# EAGLE design Board Mekanum (EAGLE 7.6.0)
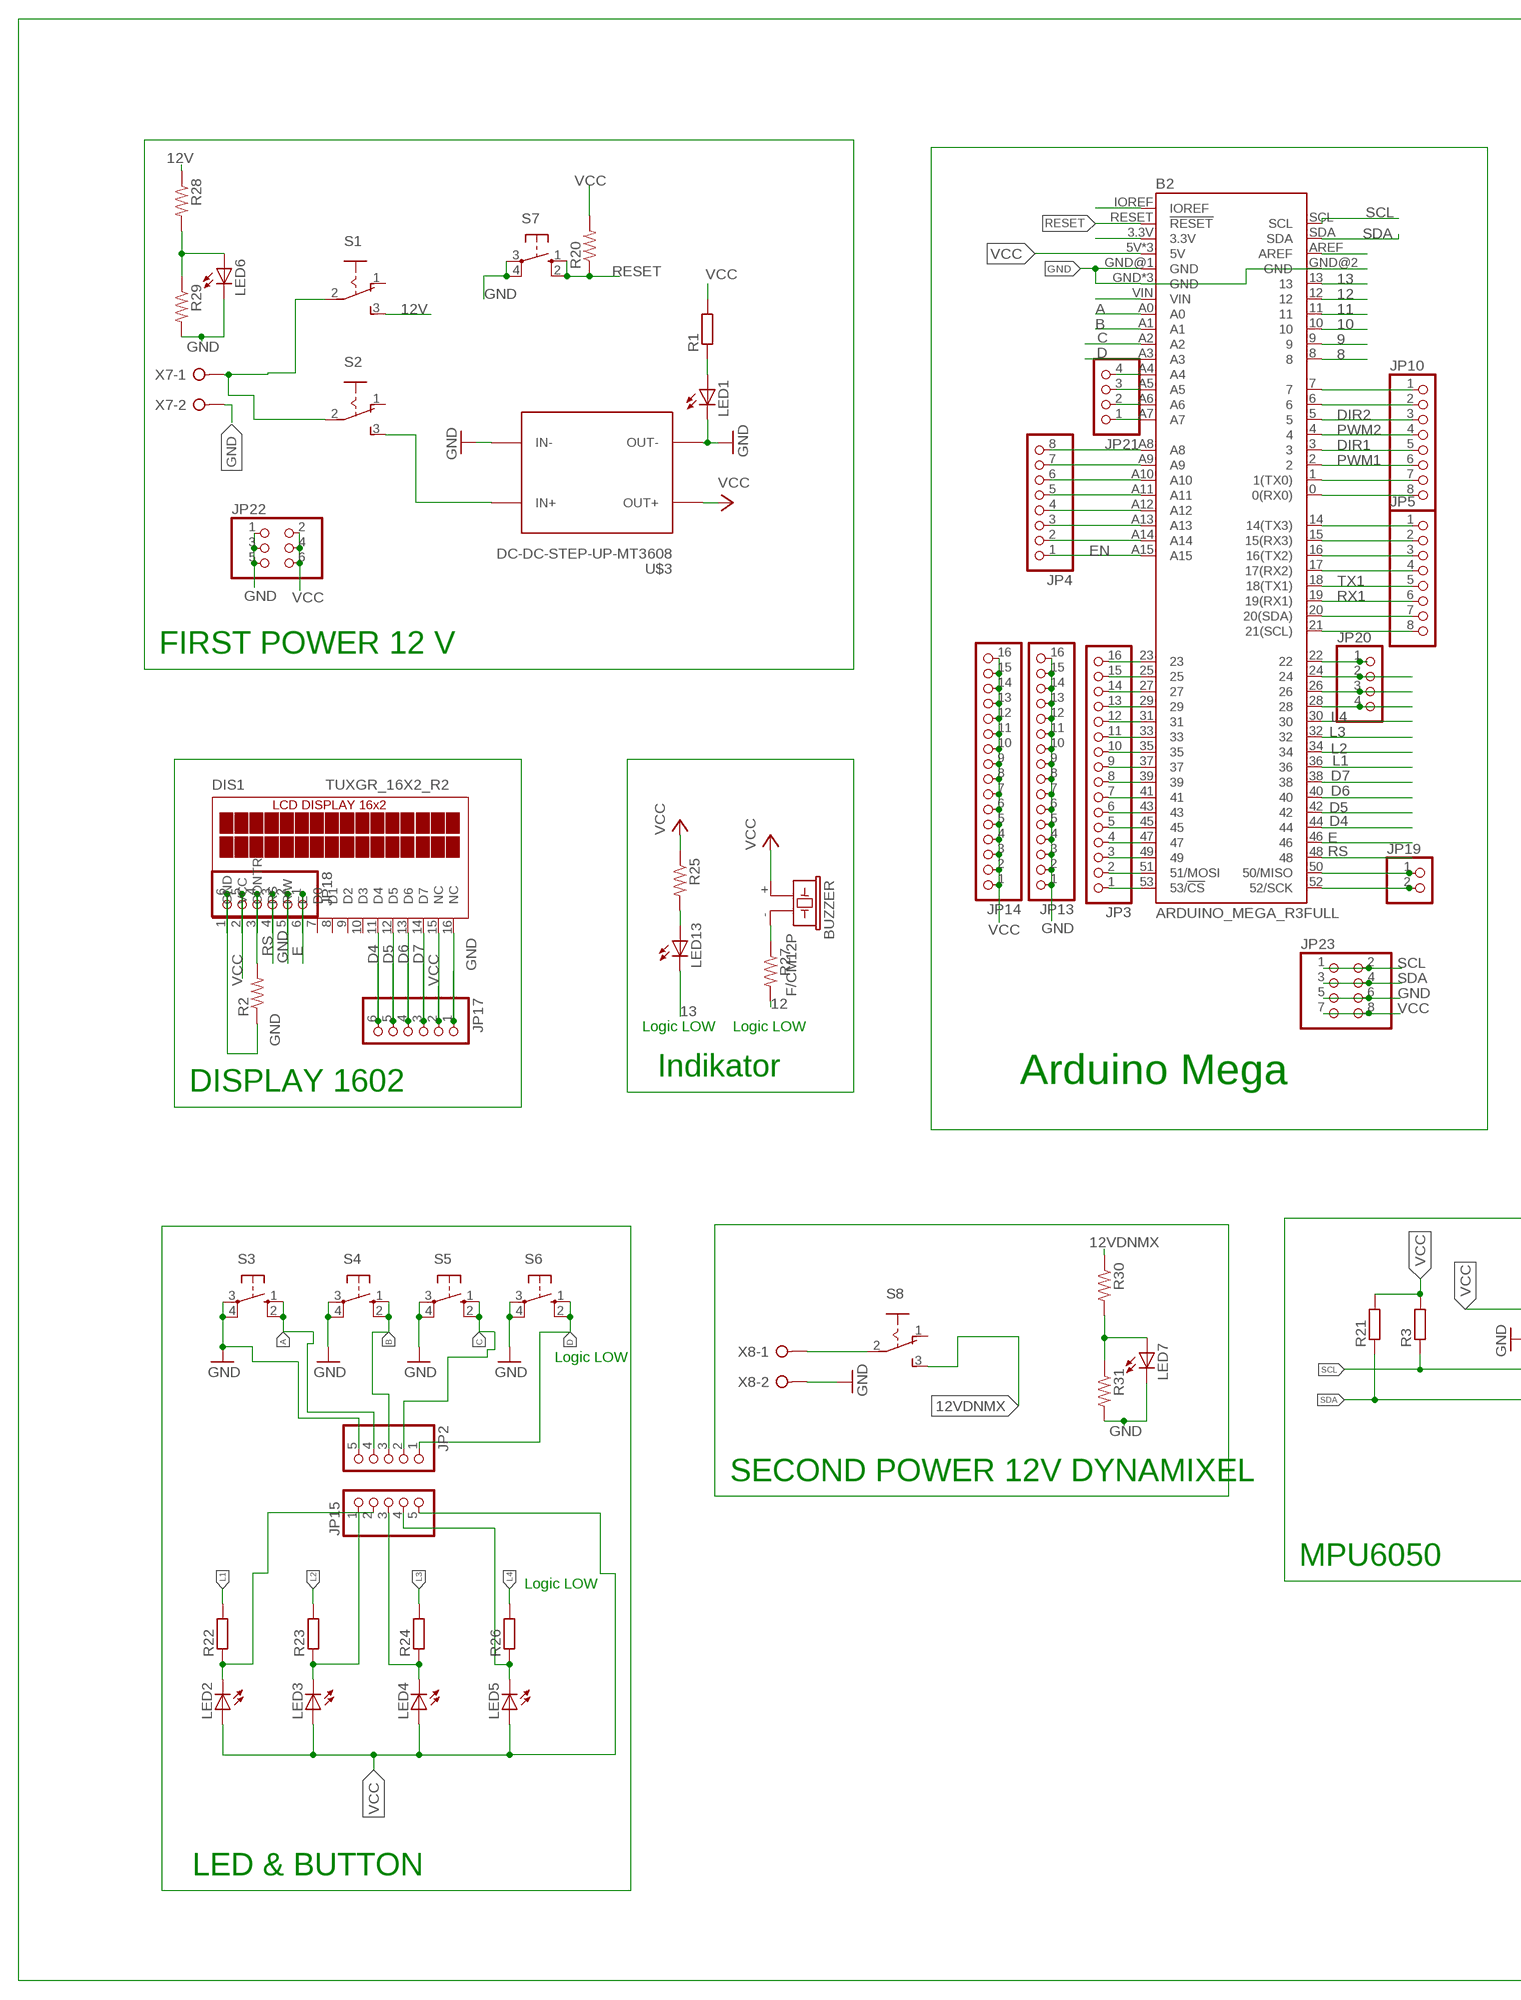
[diagram p0: schematic, sheet 1, part 1 of 2]
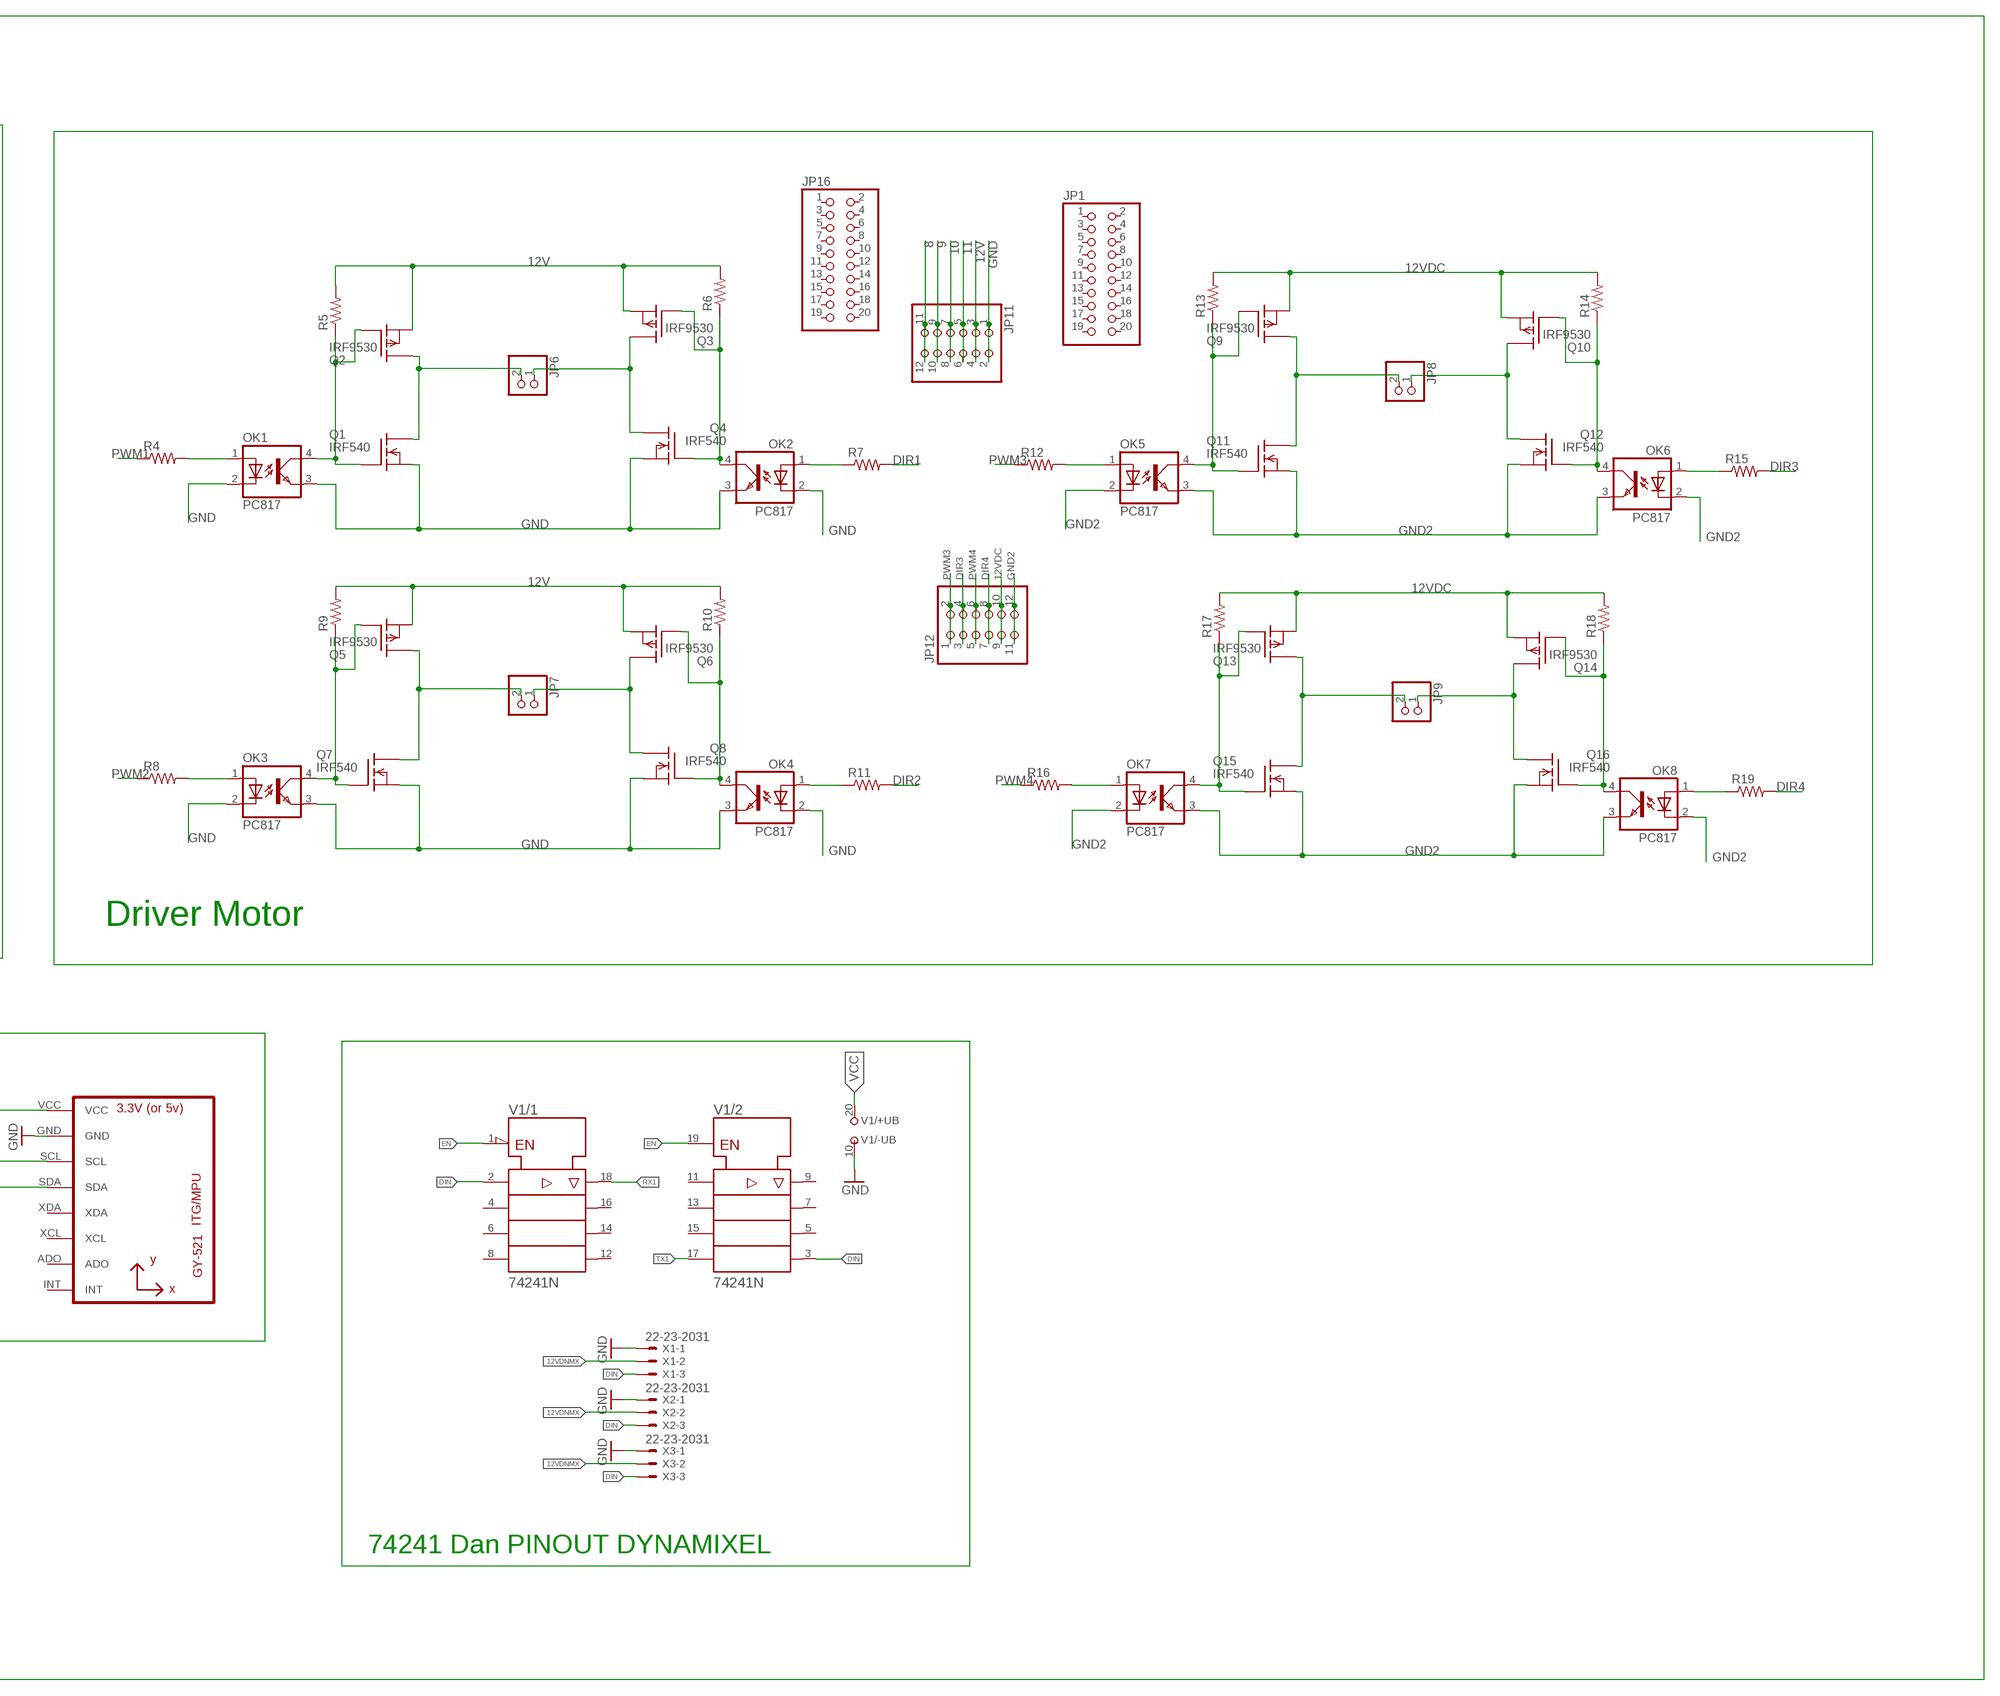
[diagram p1: schematic, sheet 1, part 2 of 2]

## Parts
B2  ARDUINO_MEGA_R3FULL  [ARDUINO_MEGA_NO_SILK]
BUZZER  F/CM12P  [F/CM12P]
DIS1  TUXGR_16X2_R2  [TUXGR_16X2_R2]
JP1  PINHD-2X10  [2X10]
JP2  PINHD-1X5  [1X05]
JP3  PINHD-1X16  [1X16]
JP4  PINHD-1X8  [1X08]
JP5  PINHD-1X8  [1X08]
JP6  PINHD-1X2  [1X02]
JP7  PINHD-1X2  [1X02]
JP8  PINHD-1X2  [1X02]
JP9  PINHD-1X2  [1X02]
JP10  PINHD-1X8  [1X08]
JP11  PINHD-2X6  [2X06]
JP12  PINHD-2X6  [2X06]
JP13  PINHD-1X16  [1X16]
JP14  PINHD-1X16  [1X16]
JP15  PINHD-1X5  [1X05]
JP16  PINHD-2X10  [2X10]
JP17  PINHD-1X6  [1X06]
JP18  PINHD-1X6  [1X06]
JP19  PINHD-1X2  [1X02]
JP20  PINHD-1X4  [1X04]
JP21  PINHD-1X4  [1X04]
JP22  PINHD-2X3  [2X03]
JP23  PINHD-2X4  [2X04]
LED1  LED3MM  [LED3MM]
LED2  LED3MM  [LED3MM]
LED3  LED3MM  [LED3MM]
LED4  LED3MM  [LED3MM]
LED5  LED3MM  [LED3MM]
LED6  LED3MM  [LED3MM]
LED7  LED3MM  [LED3MM]
LED13  LED3MM  [LED3MM]
OK1  PC817  [DIL04]
OK2  PC817  [DIL04]
OK3  PC817  [DIL04]
OK4  PC817  [DIL04]
OK5  PC817  [DIL04]
OK6  PC817  [DIL04]
OK7  PC817  [DIL04]
OK8  PC817  [DIL04]
Q1  IRF540  [TO220]
Q2  IRF9530  [TO220]
Q3  IRF9530  [TO220]
Q4  IRF540  [TO220]
Q5  IRF9530  [TO220]
Q6  IRF9530  [TO220]
Q7  IRF540  [TO220]
Q8  IRF540  [TO220]
Q9  IRF9530  [TO220]
Q10  IRF9530  [TO220]
Q11  IRF540  [TO220]
Q12  IRF540  [TO220]
Q13  IRF9530  [TO220]
Q14  IRF9530  [TO220]
Q15  IRF540  [TO220]
Q16  IRF540  [TO220]
R1  R-EU_0204/7  [0204/7@1]
R2  R-US_0207/7  [0207/7]
R3  R-EU_0207/7  [0207/7@1]
R4  R-US_0207/7  [0207/7]
R5  R-US_0207/7  [0207/7]
R6  R-US_0207/7  [0207/7]
R7  R-US_0207/7  [0207/7]
R8  R-US_0207/7  [0207/7]
R9  R-US_0207/7  [0207/7]
R10  R-US_0207/7  [0207/7]
R11  R-US_0207/7  [0207/7]
R12  R-US_0207/7  [0207/7]
R13  R-US_0207/7  [0207/7]
R14  R-US_0207/7  [0207/7]
R15  R-US_0207/7  [0207/7]
R16  R-US_0207/7  [0207/7]
R17  R-US_0207/7  [0207/7]
R18  R-US_0207/7  [0207/7]
R19  R-US_0207/7  [0207/7]
R20  R-US_0207/7  [0207/7]
R21  R-EU_0207/7  [0207/7@1]
R22  R-EU_0207/7  [0207/7@1]
R23  R-EU_0207/7  [0207/7@1]
R24  R-EU_0207/7  [0207/7@1]
R25  R-US_0207/7  [0207/7]
R26  R-EU_0207/7  [0207/7@1]
R27  R-US_0207/7  [0207/7]
R28  R-US_0207/12  [0207/12]
R29  R-US_0207/12  [0207/12]
R30  R-US_0207/12  [0207/12]
R31  R-US_0207/12  [0207/12]
S1  255SB  [255SB]
S2  255SB  [255SB]
S3  10-XX  [B3F-10XX]
S4  10-XX  [B3F-10XX]
S5  10-XX  [B3F-10XX]
S6  10-XX  [B3F-10XX]
S7  10-XX  [B3F-10XX]
S8  255SB  [255SB]
U1  GY-521MPU6050  [GY-521]
U$3  DC-DC-STEP-UP-MT3608  [DC-DC-STEP-UP-MT3608]
V1  74241N  [DIL20]
X1  22-23-2031  [22-23-2031]
X2  22-23-2031  [22-23-2031]
X3  22-23-2031  [22-23-2031]
X7  W237-02P  [W237-132]
X8  W237-02P  [W237-132]

## Nets
8: B2.8 JP11.11 JP11.12
9: B2.9 JP11.9 JP11.10
10: B2.10 JP11.7 JP11.8
11: B2.11 JP11.5 JP11.6
12: B2.12 R27.2
12V: JP11.3 JP11.4 Q2.3(S) Q3.3(S) Q5.3(S) Q6.3(S) R5.2 R6.2 R9.2 R10.2 R28.1 S1.3(S)
12VDC: JP12.9 JP12.10 Q9.3(S) Q10.3(S) Q13.3(S) Q14.3(S) R13.2 R14.2 R17.2 R18.2
12VDNMX: R30.1 S8.3(S) X1.2 X2.2 X3.2
13: B2.13 LED13.K(C)
A: B2.A0 JP2.4 S3.1(S) S3.2(S1)
B: B2.A1 JP2.3 S4.1(S) S4.2(S1)
C: B2.A2 JP2.2 S5.1(S) S5.2(S1)
D: B2.A3 JP2.1 S6.1(S) S6.2(S1)
D4: B2.44 DIS1.11(D4) JP17.6
D5: B2.42 DIS1.12(D5) JP17.5
D6: B2.40 DIS1.13(D6) JP17.4
D7: B2.38 DIS1.14(D7) JP17.3
DIN: V1.2(/1:A1) V1.3(/2:Y4) X1.3 X2.3 X3.3
DIR1: B2.3 JP10.5 R7.2
DIR2: B2.5 JP10.3 R11.2
DIR3: JP12.3 JP12.4 R15.2
DIR4: JP12.7 JP12.8 R19.2
E: B2.46 DIS1.6(E) JP18.1
EN: B2.A15 JP4.1 V1.1(/1:!G) V1.19(/2:G)
GND: B2.GND B2.GND@1(GND) B2.GND@2(GND) B2.GND@3(GND) B2.GND@4(GND) DIS1.1(GND) DIS1.5(R/W) DIS1.16(NC) JP2.5 JP11.1 JP11.2 JP13.1 JP13.2 JP13.3 JP13.4 JP13.5 JP13.6 JP13.7 JP13.8 JP13.9 JP13.10 JP13.11 JP13.12 JP13.13 JP13.14 JP13.15 JP13.16 JP17.1 JP18.2 JP18.6 JP22.1 JP22.3 JP22.5 JP23.5 JP23.6 LED1.K(C) LED6.K(C) LED7.K(C) OK1.2(C) OK1.3(EMIT) OK2.2(C) OK2.3(EMIT) OK3.2(C) OK3.3(EMIT) OK4.2(C) OK4.3(EMIT) Q1.3(S) Q4.3(S) Q7.3(S) Q8.3(S) R2.1 R29.2 R31.2 S3.3(P) S3.4(P1) S4.3(P) S4.4(P1) S5.3(P) S5.4(P1) S6.3(P) S6.4(P1) S7.3(P) S7.4(P1) U1.GND U$3.IN- U$3.OUT- V1.10(/-UB:-UB) X1.1 X2.1 X3.1 X7.2 X8.2
GND2: JP12.11 JP12.12 OK5.2(C) OK5.3(EMIT) OK6.2(C) OK6.3(EMIT) OK7.2(C) OK7.3(EMIT) OK8.2(C) OK8.3(EMIT) Q11.3(S) Q12.3(S) Q15.3(S) Q16.3(S)
L1: B2.36 R22.2
L2: B2.34 R23.2
L3: B2.32 R24.2
L4: B2.30 R26.2
N$3: BUZZER.- R27.1
N$4: S1.2(P) S2.2(P) X7.1
N$5: OK1.1(A) R4.2
N$6: S2.3(S) U$3.IN+
N$7: LED1.A R1.1
N$8: OK3.1(A) R8.2
N$9: OK1.4(COL) Q1.1(G) Q2.1(G) R5.1
N$10: JP6.2 Q1.2(D) Q2.2(D)
N$11: OK2.4(COL) Q3.1(G) Q4.1(G) R6.1
N$12: OK2.1(A) R7.1
N$13: OK3.4(COL) Q5.1(G) Q7.1(G) R9.1
N$14: JP6.1 Q3.2(D) Q4.2(D)
N$15: JP7.2 Q5.2(D) Q7.2(D)
N$16: JP7.1 Q6.2(D) Q8.2(D)
N$17: OK4.4(COL) Q6.1(G) Q8.1(G) R10.1
N$18: OK4.1(A) R11.1
N$19: OK5.1(A) R12.2
N$20: OK5.4(COL) Q9.1(G) Q11.1(G) R13.1
N$21: JP8.2 Q9.2(D) Q11.2(D)
N$22: JP8.1 Q10.2(D) Q12.2(D)
N$23: OK6.4(COL) Q10.1(G) Q12.1(G) R14.1
N$24: OK6.1(A) R15.1
N$25: OK7.1(A) R16.2
N$26: OK7.4(COL) Q13.1(G) Q15.1(G) R17.1
N$27: JP9.2 Q13.2(D) Q15.2(D)
N$28: JP9.1 Q14.2(D) Q16.2(D)
N$29: OK8.4(COL) Q14.1(G) Q16.1(G) R18.1
N$30: OK8.1(A) R19.1
N$32: DIS1.3(CONTR) JP18.4 R2.2
N$33: B2.3.3V
N$34: JP15.1 LED2.K(C) R22.1
N$36: B2.24 JP20.2
N$37: B2.VIN
N$38: S8.2(P) X8.1
N$39: B2.53(53/!CS) JP3.1
N$40: B2.51(51/MOSI) JP3.2
N$41: JP15.2 LED3.K(C) R23.1
N$42: B2.A4 JP21.4
N$43: B2.A5 JP21.3
N$45: LED7.A R30.2 R31.1
N$46: B2.A8 JP4.8
N$47: B2.A9 JP4.7
N$48: B2.A10 JP4.6
N$49: B2.A11 JP4.5
N$50: B2.A12 JP4.4
N$51: B2.A13 JP4.3
N$52: B2.A14 JP4.2
N$53: B2.26 JP20.3
N$54: B2.49 JP3.3
N$55: B2.47 JP3.4
N$56: B2.45 JP3.5
N$57: B2.43 JP3.6
N$58: B2.28 JP20.4
N$59: B2.41 JP3.7
N$60: B2.39 JP3.8
N$61: B2.37 JP3.9
N$62: B2.35 JP3.10
N$63: B2.33 JP3.11
N$64: B2.31 JP3.12
N$65: B2.29 JP3.13
N$66: B2.27 JP3.14
N$67: B2.25 JP3.15
N$68: B2.23 JP3.16
N$69: B2.20(20(SDA)) JP5.7
N$70: JP15.3 LED4.K(C) R24.1
N$71: JP15.4 LED5.K(C) R26.1
N$72: B2.AREF
N$74: LED6.A R28.2 R29.1
N$75: B2.21(21(SCL)) JP5.8
N$79: B2.A7 JP21.1
N$80: B2.7 JP10.1
N$81: B2.6 JP10.2
N$82: B2.A6 JP21.2
N$86: B2.1(1(TX0)) JP10.7
N$87: B2.0(0(RX0)) JP10.8
N$88: B2.14(14(TX3)) JP5.1
N$89: B2.15(15(RX3)) JP5.2
N$90: B2.16(16(TX2)) JP5.3
N$91: B2.17(17(RX2)) JP5.4
N$96: B2.22 JP20.1
N$110: B2.50(50/MISO) JP19.1
N$111: B2.52(52/SCK) JP19.2
N$112: LED13.A R25.2
N$114: B2.IOREF
PWM1: B2.2 JP10.6 R4.1
PWM2: B2.4 JP10.4 R8.1
PWM3: JP12.1 JP12.2 R12.1
PWM4: JP12.5 JP12.6 R16.1
RESET: B2.RESET(!RESET) R20.1 S7.1(S) S7.2(S1)
RS: B2.48 DIS1.4(RS) JP18.3
RX1: B2.19(19(RX1)) JP5.6 V1.18(/1:Y1)
SCL: B2.SCL JP23.1 JP23.2 R3.1 U1.SCL
SDA: B2.SDA JP23.3 JP23.4 R21.1 U1.SDA
TX1: B2.18(18(TX1)) JP5.5 V1.17(/2:A4)
VCC: B2.5V B2.5V@1(5V) B2.5V@2(5V) BUZZER.+ DIS1.2(VCC) DIS1.15(NC) JP14.1 JP14.2 JP14.3 JP14.4 JP14.5 JP14.6 JP14.7 JP14.8 JP14.9 JP14.10 JP14.11 JP14.12 JP14.13 JP14.14 JP14.15 JP14.16 JP15.5 JP17.2 JP18.5 JP22.2 JP22.4 JP22.6 JP23.7 JP23.8 LED2.A LED3.A LED4.A LED5.A R1.2 R3.2 R20.2 R21.2 R25.1 U1.VCC U$3.OUT+ V1.20(/+UB:+UB)
Unconnected: DIS1.7(D0) DIS1.8(D1) DIS1.9(D2) DIS1.10(D3) JP1.1 JP1.2 JP1.3 JP1.4 JP1.5 JP1.6 JP1.7 JP1.8 JP1.9 JP1.10 JP1.11 JP1.12 JP1.13 JP1.14 JP1.15 JP1.16 JP1.17 JP1.18 JP1.19 JP1.20 JP16.1 JP16.2 JP16.3 JP16.4 JP16.5 JP16.6 JP16.7 JP16.8 JP16.9 JP16.10 JP16.11 JP16.12 JP16.13 JP16.14 JP16.15 JP16.16 JP16.17 JP16.18 JP16.19 JP16.20 S1.1(O) S2.1(O) S8.1(O) U1.ADO U1.INT U1.XCL U1.XDA V1.4(/1:A2) V1.5(/2:Y3) V1.6(/1:A3) V1.7(/2:Y2) V1.8(/1:A4) V1.9(/2:Y1) V1.11(/2:A1) V1.12(/1:Y4) V1.13(/2:A2) V1.14(/1:Y3) V1.15(/2:A3) V1.16(/1:Y2)

## Notes on the sheet
- FIRST POWER 12 V
- Logic LOW | Logic LOW
- Indikator | Arduino Mega
- DISPLAY 1602 | Driver Motor
- Logic LOW
- SECOND POWER 12V DYNAMIXEL
- MPU6050
- Logic LOW
- 74241 Dan PINOUT DYNAMIXEL
- LED & BUTTON

## Library data of the parts
B2 = SparkFun-Boards:ARDUINO_MEGA_R3: Arduino Mega R3 ATmega2560 R3 compatible footprint. SparkFun Products: Arduino Mega 2560 R3 <https://www.sparkfun.com/products/11061>
BUZZER = buzzer:F/CM12P: BUZZER Source: Buerklin; OC_FARNELL: unknown; OC_NEWARK: unknown
DIS1 = display-lcd:TUXGR_16X2_R2: Tuxgraphics LCD display 16x2 characters reflective, without background light Source: tuxgr_12x2_r2.pdf; OC_FARNELL: unknown; OC_NEWARK: unknown
JP1 JP16 = pinhead:PINHD-2X10: PIN HEADER
JP2 JP15 = pinhead:PINHD-1X5: PIN HEADER
JP3 JP13 JP14 = pinhead:PINHD-1X16: PIN HEADER
JP4 JP5 JP10 = pinhead:PINHD-1X8: PIN HEADER
JP6-JP9 JP19 = pinhead:PINHD-1X2: PIN HEADER
JP11 JP12 = pinhead:PINHD-2X6: PIN HEADER
JP17 JP18 = pinhead:PINHD-1X6: PIN HEADER
JP20 JP21 = pinhead:PINHD-1X4: PIN HEADER
JP22 = pinhead:PINHD-2X3: PIN HEADER
JP23 = pinhead:PINHD-2X4: PIN HEADER
LED1-LED7 = led:LED: LED OSRAM: - CHIPLED LG R971, LG N971, LY N971, LG Q971, LY Q971, LO R971, LY R971 LH N974, LH R974 LS Q976, LO Q976, LY Q976 LO Q996 - Hyper CHIPLED LW Q18S LB Q993, LB Q99A, LB R99A - SideLED LS A670, LO A670, LY A670, LG A670, LP A670 LB A673, LV A673, LT A673, LW A673 LH A674 LY A675 LS A676, LA A676, LO A676, LY A676, LW A676 LS A679, LY A679, LG A679 - Hyper Micro SIDELED® LS Y876, LA Y876, LO Y876, LY Y876 LT Y87S - SmartLED LW L88C, LW L88S LB L89C, LB L89S, LG L890 LS L89K, LO L89K, LY L89K LS L896, LA L896, LO L896, LY L896 - TOPLED LS T670, LO T670, LY T670, LG T670, LP T670 LSG T670, LSP T670, LSY T670, LOP T670, LYG T670 LG T671, LOG T671, LSG T671 LB T673, LV T673, LT T673, LW T673 LH T674 LS T676, LA T676, LO T676, LY T676, LB T676, LH T676, LSB T676, LW T676 LB T67C, LV T67C, LT T67C, LS T67K, LO T67K, LY T67K, LW E67C LS E67B, LA E67B, LO E67B, LY E67B, LB E67C, LV E67C, LT E67C LW T67C LS T679, LY T679, LG T679 LS T770, LO T770, LY T770, LG T770, LP T770 LB T773, LV T773, LT T773, LW T773 LH T774 LS E675, LA E675, LY E675, LS T675 LS T776, LA T776, LO T776, LY T776, LB T776 LHGB T686 LT T68C, LB T68C - Hyper Mini TOPLED® LB M676 - Mini TOPLED Santana® LG M470 LS M47K, LO M47K, LY M47K Source: http://www.osram.convergy.de LUXEON: - LUMILED® LXK2-PW12-R00, LXK2-PW12-S00, LXK2-PW14-U00, LXK2-PW14-V00 LXK2-PM12-R00, LXK2-PM12-S00, LXK2-PM14-U00 LXK2-PE12-Q00, LXK2-PE12-R00, LXK2-PE12-S00, LXK2-PE14-T00, LXK2-PE14-U00 LXK2-PB12-K00, LXK2-PB12-L00, LXK2-PB12-M00, LXK2-PB14-N00, LXK2-PB14-P00, LXK2-PB14-Q00 LXK2-PR12-L00, LXK2-PR12-M00, LXK2-PR14-Q00, LXK2-PR14-R00 LXK2-PD12-Q00, LXK2-PD12-R00, LXK2-PD12-S00 LXK2-PH12-R00, LXK2-PH12-S00 LXK2-PL12-P00, LXK2-PL12-Q00, LXK2-PL12-R00 Source: www.luxeon.com KINGBRIGHT: KA-3528ASYC Source: www.kingbright.com
LED13 = SparkFun:LED: LEDs Standard schematic elements and footprints for 5mm, 3mm, 1206, and 0603 sized LEDs. 5mm - Spark Fun Electronics SKU : COM-00529 (and others)
OK1-OK8 = optocoupler:PC817: SHARP OPTO COUPLER; MPN: PC817X4J000F; OC_FARNELL: 9707727; OC_NEWARK: 97K7059
Q1 Q4 Q7 Q8 Q11 Q12 Q15 Q16 = transistor-fet:IRF540: N-Channel Enhancement MOSFET (HEXFET); 100V; 28A; 0,077Ohm
Q2 Q3 Q5 Q6 Q9 Q10 Q13 Q14 = transistor-fet:IRF9530: P-Channel Enhancement MOSFET (HEXFET); -100V; -12A; 0,3Ohm
R1 R3 R21-R24 R26 = rcl:R-EU_: RESISTOR, European symbol
R2 R4-R20 R25 R27 = adafruit:R-US_: RESISTOR, American symbol
R28-R31 = rcl:R-US_: RESISTOR, American symbol
S1 S2 S8 = switch:255SB: SLIDING SWITCH Distributor Buerklin, 11G810
S3-S7 = switch-omron:10-XX: OMRON SWITCH; MPN: B3F-1000; OC_FARNELL: 176432; OC_NEWARK: 36M3542
U1 = gy-521:GY-521
U$3 = diy-modules:DC-DC-STEP-UP-MT3608: DC/DC Step-Up Regulator based on MT3608 chip MT3608 datasheet available here: https://www.olimex.com/Products/Breadboarding/BB-PWR-3608/resources/MT3608.pdf Click here to find device on ebay.com <http://www.ebay.com/sch/mt3608+module>
V1 = 74ttl-din:74*241: Octal BUFFER and LINE DRIVER, 3-state
X1-X3 = con-molex:22-23-2031: .100" (2.54mm) Center Header - 3 Pin; MF: MOLEX; MPN: 22-23-2031; OC_FARNELL: 1462950; OC_NEWARK: 30C0862
X7 X8 = con-wago-508:W237-02P: WAGO SREW CLAMP; OC_FARNELL: unknown; OC_NEWARK: unknown

## Board
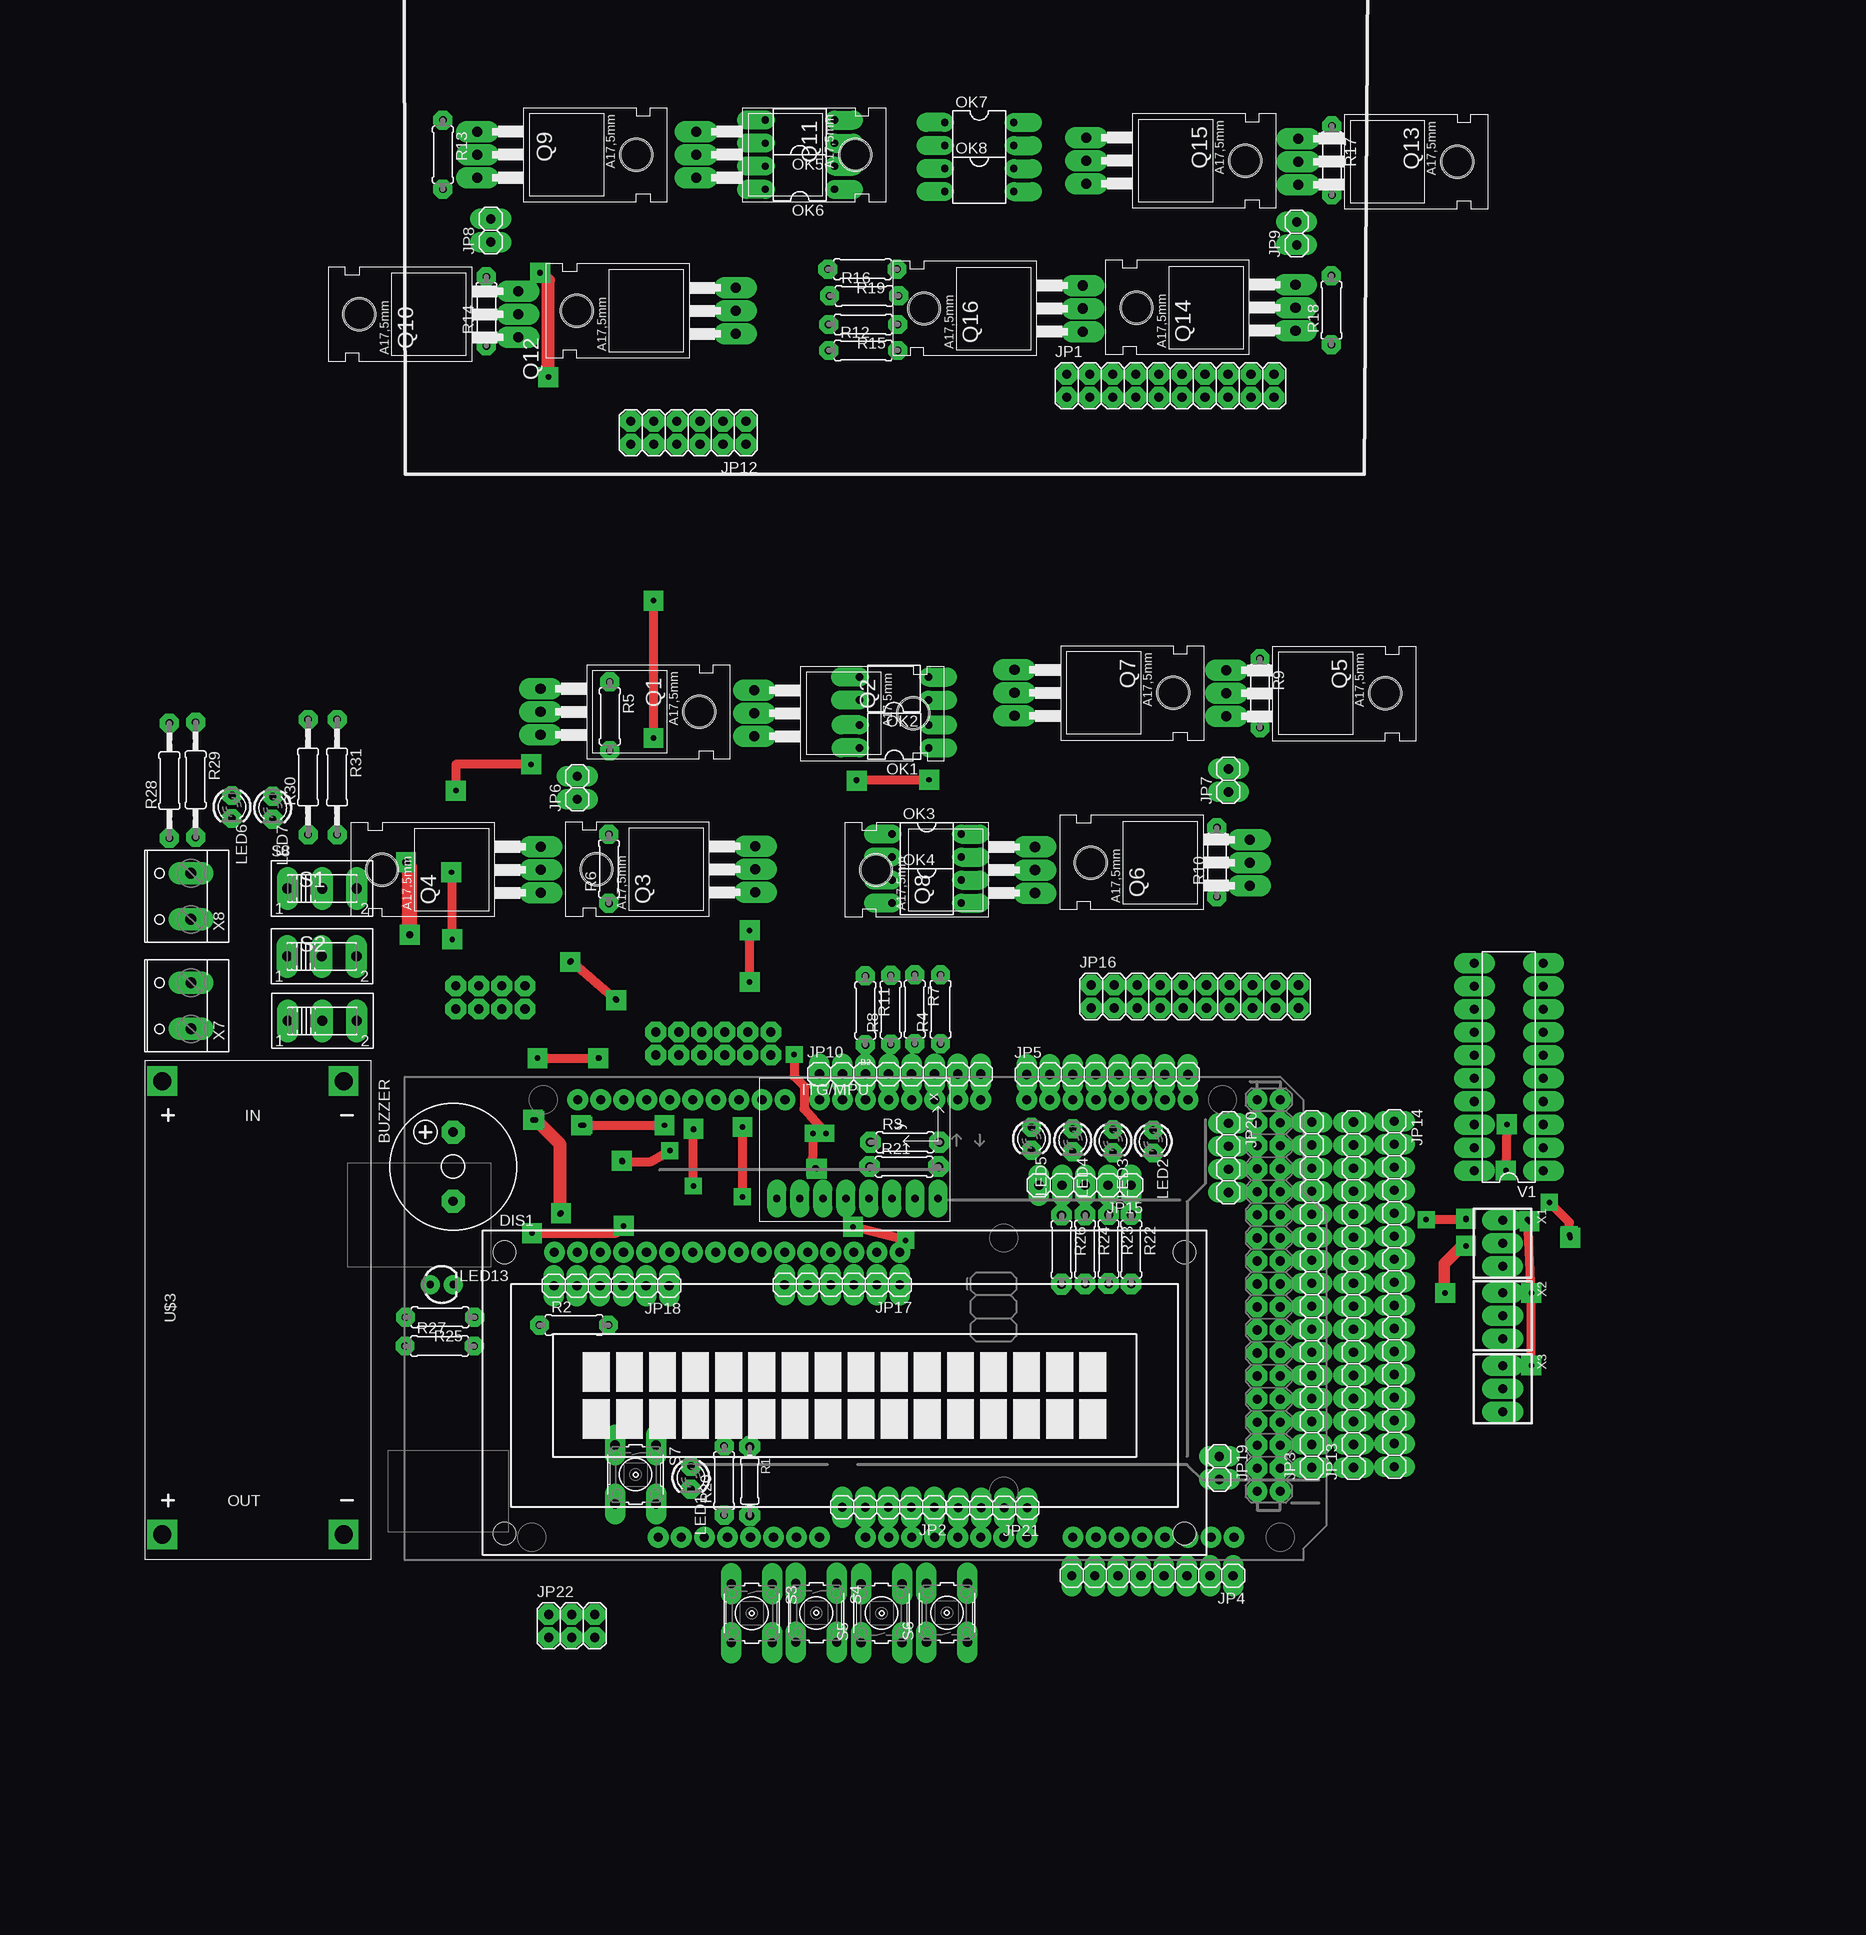
[diagram p2: board, top side]
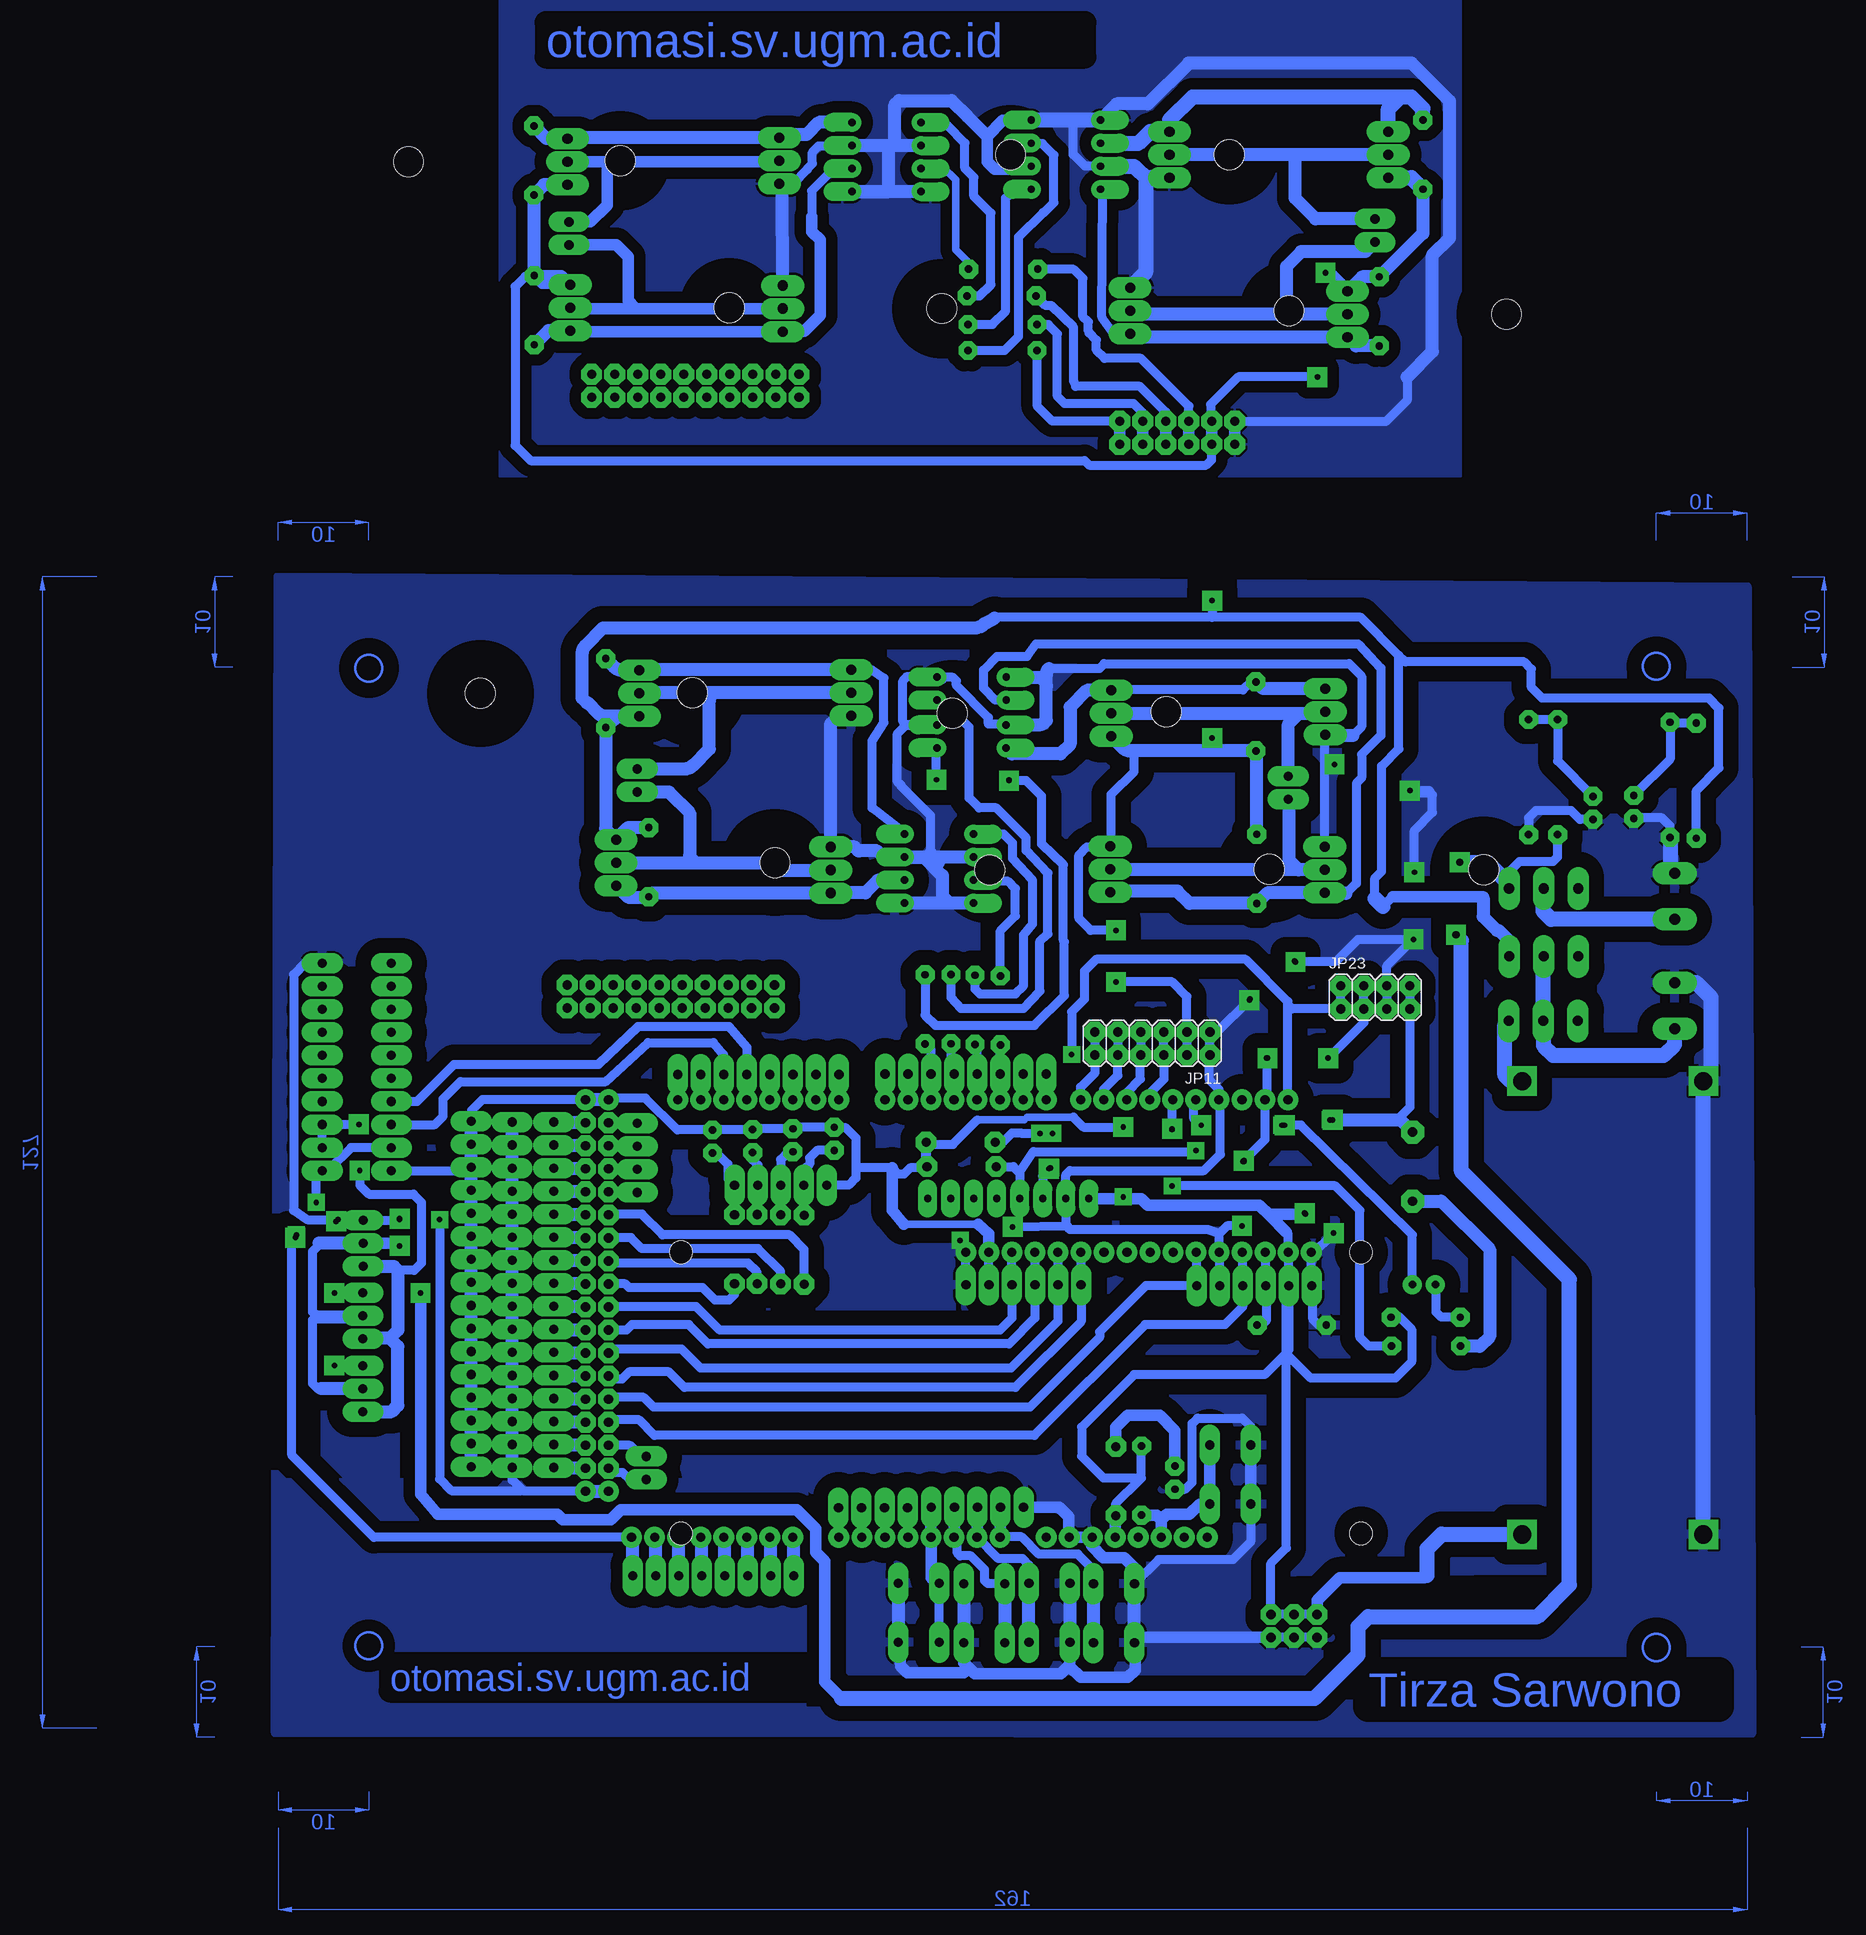
[diagram p3: board, bottom side, seen from below]

No outline drawn. Coordinates in mm, seen from the top.
Copper layers (1*16): Top 0.035mm / dielectric 1.5mm / Bottom 0.035mm
Design rules "default *": minimum track width 6mil, minimum drill 0.35mm, track to track 6mil, track to pad 6mil, pad to pad 6mil, via to via 6mil, smd to smd 6mil, copper to edge 40mil, drill to drill 6mil, minimum pad ring 25mil, minimum via ring 25mil, stop-mask expansion 4mil, vias tented up to drill 0mil, thermal gap 10mil

### Footprints (pad centres in the part's own frame; a part is rotated, then mirrored left to right if it is on the bottom)
ARDUINO_MEGA_NO_SILK = drill 1.016 pad 1.88: 0 13.97,24.13; 1 11.43,24.13; 2 8.89,24.13; 3 6.35,24.13; 3.3V -13.97,-24.13; 4 3.81,24.13; 5 1.27,24.13; 5V -11.43,-24.13; 5V@1 44.45,24.13; 5V@2 46.99,24.13; 6 -1.27,24.13; 7 -3.81,24.13; 8 -7.62,24.13; 9 -10.16,24.13; 10 -12.7,24.13; 11 -15.24,24.13; 12 -17.78,24.13; 13 -20.32,24.13; 14 19.05,24.13; 15 21.59,24.13; 16 24.13,24.13; 17 26.67,24.13; 18 29.21,24.13; 19 31.75,24.13; 20 34.29,24.13; 21 36.83,24.13; A0 1.27,-24.13; A1 3.81,-24.13; A2 6.35,-24.13; A3 8.89,-24.13; A4 11.43,-24.13; A5 13.97,-24.13; A6 16.51,-24.13; A7 19.05,-24.13; A8 24.13,-24.13; A9 26.67,-24.13; A10 29.21,-24.13; A11 31.75,-24.13; A12 34.29,-24.13; A13 36.83,-24.13; A14 39.37,-24.13; A15 41.91,-24.13; AREF -25.4,24.13; GND -8.89,-24.13; GND@1 -6.35,-24.13; GND@2 44.45,-19.05; GND@3 46.99,-19.05; GND@4 -22.86,24.13; IOREF -19.05,-24.13; NC -21.59,-24.13; RESET -16.51,-24.13; SCL -30.48,24.13; SDA -27.94,24.13; VIN -3.81,-24.13 | drill 1.016 pad 1.88 octagon: 22 44.45,21.59; 23 46.99,21.59; 24 44.45,19.05; 25 46.99,19.05; 26 44.45,16.51; 27 46.99,16.51; 28 44.45,13.97; 29 46.99,13.97; 30 44.45,11.43; 31 46.99,11.43; 32 44.45,8.89; 33 46.99,8.89; 34 44.45,6.35; 35 46.99,6.35; 36 44.45,3.81; 37 46.99,3.81; 38 44.45,1.27; 39 46.99,1.27; 40 44.45,-1.27; 41 46.99,-1.27; 42 44.45,-3.81; 43 46.99,-3.81; 44 44.45,-6.35; 45 46.99,-6.35; 46 44.45,-8.89; 47 46.99,-8.89; 48 44.45,-11.43; 49 46.99,-11.43; 50 44.45,-13.97; 51 46.99,-13.97; 52 44.45,-16.51; 53 46.99,-16.51
F/CM12P = drill 1.016 pad 2.54 octagon: + 3.81,0; - -3.81,0
TUXGR_16X2_R2 = drill 1 pad 1.676: 1 -32,15.5; 2 -29.46,15.5; 3 -26.92,15.5; 4 -24.38,15.5; 5 -21.84,15.5; 6 -19.3,15.5; 7 -16.76,15.5; 8 -14.22,15.5; 9 -11.68,15.5; 10 -9.14,15.5; 11 -6.6,15.5; 12 -4.06,15.5; 13 -1.52,15.5; 14 1.02,15.5; 15 3.56,15.5; 16 6.1,15.5 | hole 2.5: -37.5,-15.5; 37.5,-15.5; -37.5,15.5; 37.5,15.5
2X10 = drill 1.016 octagon: 1 -11.43,-1.27; 2 -11.43,1.27; 3 -8.89,-1.27; 4 -8.89,1.27; 5 -6.35,-1.27; 6 -6.35,1.27; 7 -3.81,-1.27; 8 -3.81,1.27; 9 -1.27,-1.27; 10 -1.27,1.27; 11 1.27,-1.27; 12 1.27,1.27; 13 3.81,-1.27; 14 3.81,1.27; 15 6.35,-1.27; 16 6.35,1.27; 17 8.89,-1.27; 18 8.89,1.27; 19 11.43,-1.27; 20 11.43,1.27
1X05 = drill 1.016 long: 1 -5.08,0; 2 -2.54,0; 3 0,0; 4 2.54,0; 5 5.08,0
1X16 = drill 1.016 long: 1 -19.05,0; 2 -16.51,0; 3 -13.97,0; 4 -11.43,0; 5 -8.89,0; 6 -6.35,0; 7 -3.81,0; 8 -1.27,0; 9 1.27,0; 10 3.81,0; 11 6.35,0; 12 8.89,0; 13 11.43,0; 14 13.97,0; 15 16.51,0; 16 19.05,0
1X08 = drill 1.016 long: 1 -8.89,0; 2 -6.35,0; 3 -3.81,0; 4 -1.27,0; 5 1.27,0; 6 3.81,0; 7 6.35,0; 8 8.89,0
1X02 = drill 1.016 long: 1 -1.27,0; 2 1.27,0
2X06 = drill 1.016 octagon: 1 -6.35,-1.27; 2 -6.35,1.27; 3 -3.81,-1.27; 4 -3.81,1.27; 5 -1.27,-1.27; 6 -1.27,1.27; 7 1.27,-1.27; 8 1.27,1.27; 9 3.81,-1.27; 10 3.81,1.27; 11 6.35,-1.27; 12 6.35,1.27
1X06 = drill 1.016 long: 1 -6.35,0; 2 -3.81,0; 3 -1.27,0; 4 1.27,0; 5 3.81,0; 6 6.35,0
1X04 = drill 1.016 long: 1 -3.81,0; 2 -1.27,0; 3 1.27,0; 4 3.81,0
2X03 = drill 1.016 pad 1.778 octagon: 1 -2.54,-1.27; 2 -2.54,1.27; 3 0,-1.27; 4 0,1.27; 5 2.54,-1.27; 6 2.54,1.27
2X04 = drill 1.016 octagon: 1 -3.81,-1.27; 2 -3.81,1.27; 3 -1.27,-1.27; 4 -1.27,1.27; 5 1.27,-1.27; 6 1.27,1.27; 7 3.81,-1.27; 8 3.81,1.27
LED3MM = drill 0.813 octagon: A -1.27,0; K 1.27,0
LED3MM' = drill 0.813 pad 1.88: A -1.27,0; K 1.27,0
DIL04 = drill 0.813 offset: 1 -1.27,-3.81; 2 1.27,-3.81; 3 1.27,3.81; 4 -1.27,3.81
TO220 = drill 1.118 long: 1 -2.54,-6.35; 2 0,-6.35; 3 2.54,-6.35 | hole 3.302: 0,11.176
0204/7@1 = drill 1 octagon: 1 -3.81,0; 2 3.81,0
0207/7 = drill 0.813 octagon: 1 -3.81,0; 2 3.81,0
0207/7@1 = drill 1 octagon: 1 -3.81,0; 2 3.81,0
0207/12 = drill 0.813 octagon: 1 -6.35,0; 2 6.35,0
255SB = drill 1.118 long: 1 -3.81,0; 2 0,0; 3 3.81,0
B3F-10XX = drill 1.016 long: 1 -3.251,2.261; 2 3.251,2.261; 3 -3.251,-2.261; 4 3.251,-2.261
GY-521 = drill 0.8 pad 1.778 long: ADO -8.89,-6.35; GND -8.89,6.35; INT -8.89,-8.89; SCL -8.89,3.81; SDA -8.89,1.27; VCC -8.89,8.89; XCL -8.89,-3.81; XDA -8.89,-1.27
DC-DC-STEP-UP-MT3608 = drill 2 pad 2.8 square: IN+ 50,0; IN- 50,20; OUT+ 0,0; OUT- 0,20
DIL20 = drill 1 long: 1 -11.43,-3.81; 2 -8.89,-3.81; 3 -6.35,-3.81; 4 -3.81,-3.81; 5 -1.27,-3.81; 6 1.27,-3.81; 7 3.81,-3.81; 8 6.35,-3.81; 9 8.89,-3.81; 10 11.43,-3.81; 11 11.43,3.81; 12 8.89,3.81; 13 6.35,3.81; 14 3.81,3.81; 15 1.27,3.81; 16 -1.27,3.81; 17 -3.81,3.81; 18 -6.35,3.81; 19 -8.89,3.81; 20 -11.43,3.81
22-23-2031 = drill 1 long: 1 -2.54,0; 2 0,0; 3 2.54,0
W237-132 = drill 1.194 long: 1 -2.54,-0.635; 2 2.54,-0.635

### Placement (x,y rotation side)
B2  0.21,-19.51 0 top
BUZZER  -44.01,-2.76 90 top
DIS1  -0.84,-27.71 0 top
JP1  35.1,83.35 0 top
JP2  3.98,-40.33 180 top
JP3  50.7,-16.9 90 top
JP4  33.12,-47.88 180 top
JP5  28.14,7.4 0 top
JP6  -30.31,39.02 90 top
JP7  41.5,39.83 90 top
JP8  -39.86,100.48 90 top
JP9  49.02,100.15 90 top
JP10  5.28,7.45 0 top
JP11  -15.31,10.82 180 bottom
JP12  -18.06,78.17 180 top
JP13  55.3,-16.9 90 top
JP14  59.8,-16.8 270 top
JP15  25.69,-4.81 180 top
JP16  37.8,16 0 top
JP17  -1.1,-15.8 180 top
JP18  -26.54,-15.9 180 top
JP19  40.5,-36 270 top
JP20  41.5,-1.8 270 top
JP21  15.5,-40.4 180 top
JP22  -30.93,-53.42 0 top
JP23  -39.9,15.9 0 bottom
LED1  -17.79,-37.07 270 top
LED2  33.2,0.01 270 top
LED3  28.77,0.05 270 top
LED4  24.34,0.14 270 top
LED5  19.77,0.3 270 top
LED6  -68.4,36.9 270 top
LED7  -63.9,36.8 270 top
LED13  [LED3MM']  -45.26,-15.78 0 top
OK1  4.64,44.68 90 top
OK2  4.62,49.96 90 top
OK3  8.22,32.64 270 top
OK4  8.22,27.56 270 top
OK5  -5.77,111.37 90 top
OK6  -5.77,106.29 90 top
OK7  14.02,111.12 270 top
OK8  14.02,106.04 270 top
Q1  -28.02,47.4 270 top
Q2  -4.43,47.22 270 top
Q3  -17.02,30.02 90 top
Q4  -40.67,29.97 90 top
Q5  47.62,49.43 270 top
Q6  37.48,30.76 90 top
Q7  24.25,49.48 270 top
Q8  13.81,29.95 90 top
Q9  -34.98,108.83 270 top
Q10  -43.18,91.23 90 top
Q11  -10.85,108.83 270 top
Q12  -19.21,91.61 90 top
Q13  55.55,108.07 270 top
Q14  42.54,91.97 90 top
Q15  32.18,108.17 270 top
Q16  19.1,91.87 90 top
R1  -11.29,-37.45 270 top
R2  -30.67,-20.24 0 top
R3  5.83,-0.08 0 top
R4  9.75,14.59 90 top
R5  -26.73,46.89 270 top
R6  -26.83,30.08 90 top
R7  6.9,14.59 270 top
R8  4.25,14.53 90 top
R9  44.98,49.46 270 top
R10  40.23,30.81 90 top
R11  1.45,14.47 270 top
R12  1.22,87.24 0 top
R13  -45.14,108.83 270 top
R14  -40.34,91.56 90 top
R15  1.22,90.11 180 top
R16  1.32,93.26 0 top
R17  52.91,108.2 270 top
R18  52.85,91.69 90 top
R19  1.14,96.21 180 top
R20  -14.12,-37.39 90 top
R21  5.74,-2.77 0 top
R22  30.77,-11.88 270 top
R23  28.28,-11.85 270 top
R24  25.69,-11.88 270 top
R25  -45.45,-19.38 180 top
R26  23.09,-11.92 270 top
R27  -45.5,-22.55 0 top
R28  -75.3,39.8 90 top
R29  -72.4,39.9 270 top
R30  -60,40.2 90 top
R31  -56.8,40.2 270 top
S1  -58.48,20.43 0 top
S2  -58.43,13.31 0 top
S3  -11.07,-52.02 270 top
S4  -3.96,-51.98 270 top
S5  3.24,-52.01 90 top
S6  10.45,-51.96 90 top
S7  -23.89,-36.72 270 top
S8  -58.46,27.9 0 top
U1  0.58,2.6 90 top
U$3  -56.08,-43.33 90 top
V1  72.43,8.23 90 top
X1  71.74,-11.22 270 top
X2  71.75,-19.22 270 top
X3  71.75,-27.24 270 top
X7  -73.55,14.98 90 top
X8  -73.56,27.05 90 top

### Tracks (layer width: path | path; a pad name or v marks a point on that pad's centre or on a via)
8
  Bottom 1.016: JP11.11 JP11.12 -9,9.51 -9,7.6 -7.41,6.01 B2.8
9
  Bottom 1.016: JP11.9 JP11.10 | B2.9 -9.95,5.75 -11.5,7.3 JP11.10 | JP11.10
10
  Bottom 1.016: JP11.7 JP11.8 -14,9.51 -14,6.9 -12.49,5.39 B2.10
11
  Bottom 1.016: JP11.5 JP11.6 -16.6,9.53 -16.6,6.9 -15.03,5.33 B2.11
12  (via drill 0.6 pad 1.68, 0.6 pad 2.18)
  Top 1.016: v-17.5,-4.9 v-17.5,1.3
  Bottom 1.016: R27.2 -39.15,-22.55 -38.2,-21.6 -38.2,-7.6 -35.5,-4.9 v-17.5,-4.9 | v-17.5,1.3 v-17.5,1.4 -17.5,4.55 B2.12
12V  (via drill 0.6 pad 1.68, 0.6 pad 2.18)
  Top 1.016: v-21.9,44.5 v-21.9,59.65 | v-11.3,17.6 v-11.3,23.3
  Bottom 1.016: -10.78,32.81 -10.78,33.1 | -10.78,33.1 -10.78,38.28 -13.3,40.8 -13.3,42.98 -13.4,43.08 | -39.86,26.81 -39.86,29.06 -40.6,29.8 -40.6,41.4 -42.5,43.3 -42.5,53.6 | -21.9,57.8 -38.3,57.8 -42.5,53.6 | -21.9,57.8 2,57.8 2.08,57.72 | -41.81,27 -40.73,25.93 | JP11.4 JP11.3 -19.12,15.98 -17.5,17.6 v-11.3,17.6 | -26.83,42.98 -21.9,42.98 v-21.9,44.5 | v-21.9,59.65 -21.9,57.8 | v-11.3,23.3 -8.5,23.3 -7.2,24.6 -7.2,31.6 -8.1,32.5 -10.18,32.5 -10.78,33.1 | R28.1 -75.3,38.7 -77.8,41.2 -77.8,47.8 -76.7,48.9 -58.3,48.9 -57.1,50.1 -57.1,52.1 -56.3,52.9 -43.2,52.9 -42.5,53.6
  Bottom 1.27: -41.81,27 -51.7,27 -51.8,26.9
  Bottom 1.422: R6.2 -26.83,42.98 R5.2 -13.4,43.08 -12.9,43.08 arc45 -12,43.45 Q2.3 | -10.78,32.81 arc45 Q3.3 | 2.08,57.72 3.19,57.12 arc45 4.39,56.64 45.28,56.64 47.2,54.73 arc-45 47.57,53.83 47.57,48.9 47.08,48.41 arc-45 46.91,48.34 45.83,47.26 arc-45 44.93,46.89 Q5.3 43.21,46.89 arc-45 44.1,46.52 R9.2 44.98,34.55 arc-45 44.9,34.37 Q6.3 42.59,34.55 arc45 42.41,34.62 R10.2 | -51.8,26.9 -51.8,24.8 -53.3,23.3 -53.5,23.3 -54.6,22.2 -54.6,20.49 S1.3
  Bottom 1.676: -40.73,25.93 -39.86,26.81
12VDC  (via drill 0.6)
  Top 1.422: v-33.5,84.35 -33.5,94.95 v-34.4,95.85
  Bottom 1.016: Q14.3 51.98,94.51 52.86,95.39 53.86,95.39 54.96,94.29 54.96,76.79 53.26,75.09 -7.84,75.09 -8.34,74.59 -21.24,74.59 -21.84,75.19 -21.84,76.88 JP12.10 | v-33.5,84.35 -24.8,84.35 -21.74,81.29 -21.74,79.57 JP12.9
  Bottom 1.27: R18.2 49.88,95.5 Q14.3 | JP12.10 JP12.9
  Bottom 1.422: Q13.3 51.76,105.53 R17.2 52.85,104.34 R18.2 | R13.2 -45.14,100.17 R14.2 -38.43,95.37 Q10.3 -34.76,95.85 v-34.4,95.85 | -33.57,84.28 v-33.5,84.35
  Bottom 1.676: Q9.3 -43.87,106.29 R13.2
12VDNMX  (via drill 0.6 pad 1.68, 0.6 pad 2.18, 0.8 pad 2.18)
  Top 1.27: v67.7,-11.5 67.3,-11.5 65.3,-13.5 65.3,-16.4 v65.4,-16.7
  Top 1.676: v-48.8,22.8 -48.8,30.3 -49.2,30.7 v-49.2,30.8
  Bottom 1.016: 76.36,-27.25 76.75,-27.25 77.3,-26.7 77.3,-19.7 76.9,-19.3 | X2.2 76.88,-19.22 77.3,-18.8 77.3,-12.12 76.4,-11.21 | S8.3 -54.65,28.4 -54.65,29.75 -55.8,30.9 -59.5,30.9 -60,31.4 R30.1
  Bottom 1.27: X1.2 67.98,-11.21 v67.7,-11.5 | v65.4,-16.7 65.4,-38.9 63.5,-41.1 50.3,-41.1 49.7,-41.7 44.4,-41.7 43.3,-40.6 23.9,-40.6 21.8,-42.7 21.8,-45.3 20.8,-46.3 20.8,-59.6 19,-61.4
  Bottom 1.422: X3.2 76.36,-27.25 | 76.9,-19.3 71.83,-19.3 X2.2 | X1.2 76.4,-11.21 76.61,-11.21
  Bottom 1.676: -54.6,27.95 S8.3 | 19,-61.4 -33.2,-61.4 -38,-56.6 -38,-53.5 -39.1,-52.4 -57.8,-52.4 -61.3,-48.9 -61.3,-15.2 -49.4,-3.3 -49.4,22.2 v-48.8,22.8 | v-49.2,30.8 -52.25,30.8 -54.65,28.4
13  (via drill 0.6 pad 1.68, 0.6 pad 2.18)
  Top 1.016: v-29.6,1.8 v-20.7,1.8
  Bottom 1.016: LED13.K -43.99,-10.29 -31.7,1.8 v-29.9,1.8 v-29.7,1.8 v-29.6,1.8 | v-20.7,1.8 -20.6,1.8 -19.9,2.5 -19.9,4.41 B2.13
A
  Bottom 1.016: S3.1 -8.81,-47.21 -7.1,-45.5 -2.8,-45.5 -0.9,-43.6 1.44,-43.6 B2.A0
  Bottom 1.27: B2.A0 1.48,-40.37 JP2.4
  Bottom 1.422: S3.1 S3.2
B
  Bottom 1.016: S4.1 -1.7,-46.7 -1,-46 1.67,-46 B2.A1
  Bottom 1.27: B2.A1 4.02,-40.37 JP2.3
  Bottom 1.422: S4.2 S4.1
C
  Bottom 1.016: S5.2 2.84,-48.76 3.2,-48.4 3.2,-47.2 4.7,-45.7 5.9,-45.7 6.2,-45.4 6.2,-44.01 B2.A2
  Bottom 1.27: B2.A2 6.56,-40.37 JP2.2
  Bottom 1.422: S5.2 S5.1
D
  Bottom 1.016: S6.1 S6.2
  Bottom 1.27: JP2.1 9.1,-40.37 B2.A3 9.1,-48.1 8.49,-48.71 S6.2
D4
  Bottom 1.016: DIS1.11 JP17.6 -7.45,-19.85 -0.2,-27.1 36.3,-27.1 38,-25.4 42.4,-25.4 43.2,-26.2 44.33,-26.2 B2.44
D5
  Bottom 1.016: DIS1.12 -4.9,-15.79 | -4.9,-15.79 JP17.5 | -4.9,-15.79 -4.9,-19.8 0.3,-25 34.5,-25 36.6,-22.9 44.24,-22.9 B2.42
D6
  Bottom 1.016: DIS1.13 -2.36,-15.79 | -2.36,-15.79 JP17.4 | -2.36,-15.79 -2.36,-19.44 0.5,-22.3 33.7,-22.3 35.8,-20.2 42.1,-20.2 42.7,-20.8 44.65,-20.8 B2.40
D7
  Bottom 1.016: DIS1.14 JP17.3 0.17,-19.47 1.5,-20.8 32.4,-20.8 35,-18.2 44.62,-18.2 B2.38
DIN  (via drill 0.6 pad 1.02, 0.6 pad 1.68, 0.6 pad 2.18)
  Top 1.016: v72.2,1.9 v72.1,-3.2
  Bottom 1.016: V1.3 V1.2 76.24,1.84 76.3,1.9 v72.2,1.9 | v72.1,-3.2 72.1,-4.8 71.1,-5.8 66.2,-5.8 65.3,-6.7 65.3,-13.4 66.1,-14.2 67.9,-14.2
  Bottom 1.422: X3.3 68.58,-29.79 67.9,-29.1 67.9,-22.6 68.8,-21.7 | 68.8,-21.7 71.69,-21.7 X2.3 | X1.3 68.34,-13.76 67.9,-14.2 67.9,-20.8 68.8,-21.7
DIR1
  Bottom 1.016: B2.3 6.56,7.44 JP10.5 6.9,7.8 R7.2
DIR2
  Bottom 1.016: B2.5 1.48,7.44 JP10.3 1.47,10.64 R11.2
DIR3
  Bottom 1.016: JP12.3 -14.25,80.38 -13.24,81.39 -5.64,81.39 -4.84,82.19 -4.84,89.09 -3.84,90.09 -2.62,90.09 R15.2
  Bottom 1.27: JP12.4 JP12.3
DIR4
  Bottom 1.016: JP12.7 -19.33,81.1 -14.04,86.39 -10.04,86.39 -9.14,87.29 -9.14,88.39 -8.34,89.19 -8.34,89.29 -8.24,89.39 -8.24,90.39 -7.64,90.99 -7.64,95.19 -6.64,96.19 -2.69,96.19 R19.2
  Bottom 1.27: JP12.8 JP12.7
E
  Bottom 1.016: DIS1.6 -20.19,-12.26 JP18.1 -14.6,-15.9 -9.5,-21 -9.5,-21.6 -1.8,-29.3 39.7,-29.3 40.8,-28.2 44.46,-28.2 B2.46
EN  (via drill 0.6 pad 1.68)
  Top 1.016: v79.1,-10.3 79.1,-8.9 v76.9,-6.7
  Bottom 1.016: B2.A15 70.56,-43.65 79.6,-34.6 79.6,-10.8 v79.1,-10.3 | v76.9,-6.7 76.9,-3.87 V1.1 76.03,-3 75.4,-3 73.06,-0.66 V1.19
  Bottom 1.422: JP4.1 42.01,-43.76 B2.A15
GND  (via drill 0.6 pad 1.02, 0.6 pad 1.68, 0.6 pad 2.18)
  Top 1.016: v5.9,-10.9 v0.1,-9.4 | v74.9,-24.7 v74.9,-16.7 v74.5,-8.6 | v67.7,-8.6 v63.3,-8.6 | v-35.4,41.6 -43.7,41.6 v-43.7,38.7 | v-26.1,15.7 v-31,19.9 | v-44.1,22.3 -44.1,29.6 v-44.2,29.7 | v-35.3,-10.1 -26,-10.1 v-25.2,-9.3
  Bottom 1.016: 9.14,31.75 9.14,35.94 12.4,39.2 12.4,39.3 12.8,39.7 12.8,45 11.9,45.9 8.5,45.9 OK1.2 11.85,45.95 12.2,46.3 12.2,50.8 11.7,51.3 8.49,51.3 OK2.2 8.39,51.2 6.7,51.2 6.3,50.8 6.3,50.3 2.76,46.76 2.76,46.08 0.96,46.08 OK1.3 | -3.91,52.19 -9.49,52.19 -10,52.7 -37,52.7 -38.4,51.3 -38.4,45.76 -37.42,44.78 | JP18.2 -22.73,-12.26 DIS1.5 -22.68,-10.18 | DIS1.1 -32.84,-12.56 | JP17.1 DIS1.16 5.66,-11.24 v5.9,-10.9 | R2.1 -33.64,-20.24 -33,-19.6 -33,-16.01 JP18.6 -32.84,-15.85 -32.84,-12.56 | LED1.K -18.96,-38.34 -19.7,-37.6 -19.7,-31.1 -20.3,-30.5 -25.2,-30.5 -26.2,-31.5 -26.2,-33.42 S7.3 | S7.4 -26.15,-44.15 -24.2,-46.1 -15.99,-46.1 S3.3 | B2.GND@3 54.03,-38.56 54.2,-38.4 | 54.2,-38.4 55.3,-37.3 JP13.1 | X3.1 v74.89,-24.7 v74.9,-24.7 | V1.10 78.14,19.66 79.4,18.4 79.4,-7.6 77.9,-8.6 v74.5,-8.6 71.76,-8.7 X1.1 67.78,-8.68 v67.7,-8.6 | v0.1,-9.4 -5.8,-9.3 -5.8,-9.1 | -5.8,-9.1 -5.8,-6.33 U1.GND -5.77,-3.63 -6.2,-3.2 -21,-3.2 -22.8,-1.4 -22.8,4.46 B2.GND@4 -22.65,5.75 -21.6,6.8 -21.6,9.49 JP11.2 JP11.1 -22.49,12.09 v-26,15.6 v-26.1,15.7 | -22.68,-10.18 -21.4,-9.7 -6.2,-9.7 -5.8,-9.1 | JP22.1 JP22.3 JP22.5 | Q1.3 -34.32,44.81 Q4.3 -34.3,32.51 -34.3,41.6 v-35.4,41.6 | v63.3,-8.6 63.3,-37.2 62,-38.5 54.3,-38.5 54.2,-38.4 | v-31,19.9 -35.6,19.9 -38,22.3 v-44.1,22.3 -41.17,19.37 JP23.6 JP23.5 | v-44.2,29.7 -44.2,34.3 -46.2,36.3 -46.2,38.2 -45.8,38.6 | -32.84,-12.56 v-35.3,-10.1 | v-25.2,-9.3 -23.55,-9.3 -22.68,-10.18 | R29.2 -72.4,34.8 -71.5,35.7 -68.47,35.7 LED6.K | LED7.K -62.47,35.53 -61.5,36.5 -57.6,36.5 -56.8,35.7 R31.2 | v74.9,-16.7 71.77,-16.7 X2.1 74.88,-16.68 v74.9,-16.7
  Bottom 1.27: JP2.5 -5.03,-40.33 -6.1,-41.4 -6.1,-43.61 B2.GND@1 B2.GND -8.6,-43.72 -8.6,-44.6 -9.9,-45.9 -12.2,-45.9 -13.33,-47.03 S3.3 | S5.3 5.5,-57.5 4.95,-58.05 | 4.95,-58.05 4.3,-58.7 -5.2,-58.7 -6.2,-57.7 -6.2,-55.25 S4.4 | S6.3 12.41,-57.89 11.7,-58.6 5.5,-58.6 4.95,-58.05 | S4.3 -6.22,-57.92 -7.4,-59.1 -12.6,-59.1 -13.4,-58.3 -13.4,-55.34 S3.4 -13.91,-54.69 JP22.5 | S7.4 S7.3 | -45.8,38.6 -43.8,38.6 v-43.7,38.7
  Bottom 1.422: -3.61,50.21 -3.61,46.43 -3.42,46.24 arc45 -2.72,45.95 OK1.3 0.87,45.98 arc-45 1.09,46.08 | -3.61,50.21 arc-45 -3.32,50.92 -3.1,51.13 0.56,51.13 arc45 OK2.3 | -3.61,50.21 -3.61,51.48 arc45 -3.91,52.19 | -37.42,44.78 -34.56,44.78 arc45 Q1.3 | 18,46.7 arc45 Q7.3 17.93,46.91 arc45 18.11,46.84 19.37,46.84 20.09,46.13 arc-45 20.16,45.95 Q8.3 17.55,32.49 17.19,32.13 arc-45 17.01,32.06 15.06,32.06 14.45,31.45 arc-45 14.27,31.37 OK3.3 | 8,51.14 arc-45 8.23,51.23 OK2.2 8.46,51.2 arc45 8.69,51.11 | OK3.2 8.25,31.37 | 8.25,31.37 OK3.3 | OK4.2 7.05,26.29 | 7.05,26.29 OK4.3 | OK3.3 9.98,31.37 arc45 9.8,31.3 7.84,29.34 7.84,27.18 arc-45 7.77,27 7.05,26.29 | 9.14,31.75 arc-45 9.06,31.57 8.25,30.76 8.25,31.37 | S3.4 S3.3 | S4.3 S4.4 | S5.4 S5.3 | S6.4 S6.3 | JP13.1 JP13.2 JP13.3 JP13.4 JP13.5 JP13.6 JP13.7 JP13.8 JP13.9 JP13.10 JP13.11 JP13.12 JP13.13 JP13.14 JP13.15 JP13.16 | B2.GND@3 B2.GND@2
  Bottom 1.676: -73.04,29.7 X8.2 -72.4,30.11 R29.2 | X7.2 -75.28,17.52 -76.9,15.9 -76.9,7.49 U$3.IN- U$3.OUT-
  pour Bottom (isolate 1.676): -81.4,-65.3 81.4,-65.2 81.1,62.3 -80.9,61.2
GND2
  Bottom 1.016: Q15.3 24.3,105.63 22.73,107.21 22.73,107.31 22.2,107.84 22.2,109.09 21.49,109.8 17.88,109.8 OK7.3 | OK6.3 -7.9,107.56 -6.58,108.88 -6.58,112.64 | -43.4,84.35 -43.4,81.75 -41.04,79.39 -25.21,79.39 -24.41,78.59
  Bottom 1.27: OK5.2 1.17,112.64 2.92,110.89 2.92,108.05 2.08,107.21 -1.6,107.21 OK6.2 | JP12.12 -24.41,78.59 JP12.11
  Bottom 1.422: 13.74,109.85 OK7.2 13.08,109.85 13.08,114.34 12.62,114.8 6.86,114.8 5.08,113.02 5.05,113.02 2.92,110.89 | 13.74,109.85 OK7.3 | OK8.2 OK8.3 13.74,104.77 13.74,109.85 | Q16.3 25.52,105.33 Q15.3 | -43.4,84.35 -46.2,87.15 -46.2,97.75 -48.1,99.65 -48.1,114.75 -43.9,118.95 -19.3,118.95 -14.8,114.45 -11.38,114.45 OK5.3
  Bottom 1.676: Q11.3 -14.56,106.29 | -14.56,106.29 -13.54,107.31 -13.52,107.31 -13.31,107.51 -9.63,107.51 OK6.3 | OK5.3 -6.58,112.64 OK5.2 | -14.56,106.29 -14.56,95.85 Q12.3
  pour Bottom (isolate 1.27): -49.34,73.39 56.66,73.39 56.66,128.39 -49.34,128.39
KOTAK
  pour Bottom (isolate 1.27): -2.34,73.39 56.66,73.39 56.66,84.39 -2.34,83.39
L1
  Bottom 1.016: R22.2 30.77,-16.88 31.4,-17.5 32.9,-17.5 34.3,-16.1 42.4,-16.1 42.8,-15.7 B2.36
L2
  Bottom 1.016: R23.2 28.28,-14.42 29.3,-13.4 44.43,-13.4 B2.34
L3
  Bottom 1.016: R24.2 25.69,-14.31 28.2,-11.8 41,-11.8 42.2,-10.6 44.64,-10.6 B2.32
L4
  Bottom 1.016: R26.2 23.09,-11.91 24.7,-10.3 38.7,-10.3 41,-8 44.58,-8 B2.30
N$1
  pour Bottom (isolate 1.27): 23.1,-65.3 81.1,-65.3 80.8,-37.3 22.8,-37.3
N$2
  pour Bottom (isolate 1.676): -60.7,53.5 76.1,52.7 76.3,-48.4 -60.5,-47.6
N$3
  Bottom 1.422: BUZZER.- -47.17,-6.57 -52.5,-11.9 -52.5,-21.5 -51.4,-22.6 -49.37,-22.6 R27.1
N$4
  Bottom 1.676: X7.1 -72.9,12.42 -72.9,10.7 -71.7,9.5 -59.5,9.5 -58.43,10.57 S2.2 -58.43,20.38 S1.2
N$5  (via drill 0.6 pad 1.68, 0.6 pad 2.18)
  Top 1.016: v0.5,39.9 v8.5,39.9
  Bottom 1.016: R4.2 9.75,13.95 8.6,12.8 -2.3,12.8 -5.6,16.1 -5.6,22 -5.5,22.2 -5.5,30.5 -3.1,32.8 -3.1,38.1 -1.4,39.8 0.4,39.8 v0.5,39.9 | v8.5,39.9 8.5,43.36 OK1.1
N$6
  Bottom 1.676: U$3.IN+ -54.83,6.67 -54.2,7.3 -54.2,12.89 S2.3
N$7
  Bottom 1.27: R1.1 -11.29,-31.51 -12.6,-30.2 -16.1,-30.2 -17.8,-31.9 -17.8,-35.79 LED1.A
N$8
  Bottom 1.016: R8.2 4.25,16.85 3.7,16.3 -0.2,16.3 -1.1,17.2 -1.1,22.8 -2.1,24 -2.1,28.8 0.1,31.2 0.1,32.9 1.1,33.9 OK3.1
N$9
  Bottom 1.016: R5.1 -26.2,50.7 -25.3,49.8 -10.82,49.8 Q2.1
  Bottom 1.422: Q2.1 -8.08,49.76 -6.23,47.91 -6.23,43.82 -5.16,42.75 0.17,42.75 OK1.4 | Q1.1 -27.49,49.94 R5.1
N$10
  Bottom 1.422: JP6.2 -30.31,46.03 -31.5,47.22 | -31.5,47.22 -34.19,47.22 Q1.2 | Q2.2 -31.5,47.22
N$11
  Bottom 1.016: OK2.4 1.99,48.69 3.3,50 3.3,52 1.8,53.5 -1.5,53.5 -2.5,54.9 -38,54.9 -40.5,52.2 -40.5,44.8 -38.4,42.7 -38.4,40.1 -37.8,39.5 -37.8,28.47 -36.68,27.36
  Bottom 1.422: Q3.1 -10.8,27.61 -18.07,27.61 -19.41,26.27 R6.1 -28,27.43 Q4.1 arc-45 -34.51,27.36 -36.68,27.36
N$12
  Bottom 1.016: R7.1 6.9,15.9 5.8,14.7 -1.1,14.7 -2.9,16.6 -2.9,22.1 -3.8,22.9 -3.8,29.6 -1.4,32.1 -1.4,33.5 1.9,36.8 3.8,36.8 4.9,37.9 4.9,45.7 7.7,48.5 8.23,48.5 OK2.1
N$13
  Bottom 1.016: OK3.4 12.03,34.03 15.6,36.8 15.6,44.2 14.3,46.2 14.3,51.1 15.6,52 17.88,52 Q7.1
  Bottom 1.422: Q7.1 41.15,52.02 arc-45 Q5.1 43.16,51.97 arc45 44.05,52.34 R9.1
N$14
  Bottom 1.422: JP6.1 -30.38,37.67 -30.38,31.04 -31.45,29.97 Q4.2 -34.27,30.02 Q3.2
N$15
  Bottom 1.422: Q7.2 33.17,49.48 | 33.17,49.48 41.15,49.48 arc-45 Q5.2 | JP7.2 36.28,41.1 arc-45 35.38,41.47 33.55,43.31 33.55,48.57 arc45 33.17,49.47 33.17,49.48
N$16
  Bottom 1.422: Q6.2 35.07,30.76 | 35.07,30.76 27.15,30.76 arc45 26.97,30.69 26.21,29.92 20.22,29.92 arc-45 Q8.2 | JP7.1 38.15,38.56 arc45 37.97,38.48 35.73,36.25 35.73,31.53 arc-45 35.66,31.35 35.07,30.76
N$17
  Bottom 1.422: OK4.4 14.85,28.83 arc-45 15.03,28.76 16.35,27.43 20.1,27.43 arc-45 Q8.1 39.72,27.41 arc-45 39.9,27.33 R10.1 arc45 40.35,26.95 42.54,26.95 43.79,28.2 arc-45 Q6.1
N$18
  Bottom 1.016: 4.38,28.8 OK4.1 4.28,28.7 0.6,28.7 -0.2,27.9 -0.2,24.9 1.46,23.25 R11.1
N$19
  Bottom 1.016: R12.2 0.99,87.24 -0.56,88.79 -0.56,99.77 -3.25,102.46 -3.36,102.46 -4.45,103.55 -4.45,108.78 -3.18,110.05 -2.01,110.05 OK5.1
N$20
  Bottom 1.676: R13.1 -45.14,113.91 -43.87,115.18 -42.6,115.18 | -42.6,115.18 -19.74,115.18 -17.2,112.64 Q11.1 -15.06,111.37 -13.74,110.05 -9.63,110.05 OK5.4 | Q9.1 -41.33,113.91 -42.6,115.18
N$21
  Bottom 1.422: Q9.2 -31.42,108.83 | -31.42,108.83 Q11.2 | JP8.2 -33.33,101.75 -31.04,104.03 -31.04,108.45 -31.42,108.83
N$22
  Bottom 1.422: Q10.2 -29.09,91.23 | -29.09,91.23 -13.24,91.23 Q12.2 | JP8.1 -39.85,99.18 -38.81,98.14 -31.73,98.14 -30.08,96.49 -30.08,92.22 -29.09,91.23
N$23
  Bottom 1.016: Q12.1 -11.05,89.07 -9.74,90.89 -9.84,104.76 OK6.4
  Bottom 1.422: Q12.1 -13.24,88.69 Q10.1 -37.77,87.75 R14.1
N$24
  Bottom 1.016: R15.1 2.33,90.11 0.86,91.59 0.86,104.03 0,104.9 -1.83,104.9 OK6.1
N$25
  Bottom 1.016: R16.2 3.76,93.26 2.51,94.51 2.51,102.38 4.37,104.24 4.37,106.34 5.36,107.33 5.36,110.1 7.34,112.08 9.9,112.08 OK7.1
N$26
  Bottom 1.422: OK7.4 21.46,112.39 22.81,111.04 25.5,111.04 Q15.1 49.09,110.71 Q13.1 51.51,110.61 R17.1
N$27
  Bottom 1.27: Q13.2 44.09,108.07 | 44.09,108.07 25.93,108.07 Q15.2 | JP9.2 46.66,101.42 44.83,103.25 44.83,107.33 44.09,108.07
N$28
  Bottom 1.27: Q16.2 41.65,91.87 | 41.65,91.87 48.79,91.87 Q14.2 | JP9.1 43.84,98.88 42.52,97.56 42.52,92.73 41.65,91.87
N$29
  Bottom 1.016: OK8.4 19.81,107.31 22.27,104.85 22.27,102 22.25,101.97
  Bottom 1.27: Q14.1 48.79,89.33 Q16.1 25.42,89.35 23.09,89.35 21.33,91.1 21.33,99.44 22.25,100.35 22.25,101.97
  Bottom 1.422: R18.1 51.3,89.43 Q14.1 48.56,89.1
N$30
  Bottom 0.813: R19.1 4.95,96.89 6.4,98.34 6.4,106.06 7.79,107.46 10.06,107.46 OK8.1
N$32
  Bottom 1.016: DIS1.3 -27.81,-12.26 JP18.4 -27.9,-15.99 -27.9,-19.7 -27.36,-20.24 R2.2
N$34
  Bottom 1.016: R22.1 JP15.1 31.5,-4.07 31.5,-2.5 32.74,-1.26 LED2.K
N$36
  Bottom 1.016: B2.24 41.56,-0.47 JP20.2
N$38
  Bottom 1.676: X8.1 -59.29,24.51 -58.4,25.4 -58.4,27.85 S8.2
N$39
  Bottom 1.422: B2.53 50.62,-36.02 JP3.1
N$40
  Bottom 1.422: B2.51 50.62,-33.48 JP3.2
N$41
  Bottom 1.016: R23.1 28.28,-4.86 JP15.2 28.2,-4.78 28.2,-2.6 28.77,-2.03 LED3.K
N$42
  Bottom 1.016: B2.A4 11.64,-40.45 JP21.4
N$43
  Bottom 1.016: B2.A5 14.18,-40.45 JP21.3
N$45
  Bottom 1.016: R31.1 R30.2 -60,41.97 LED7.A
N$46
  Bottom 1.422: JP4.8 24.23,-43.76 B2.A8
N$47
  Bottom 1.422: JP4.7 26.77,-43.76 B2.A9
N$48
  Bottom 1.422: JP4.6 29.31,-43.76 B2.A10
N$49
  Bottom 1.422: JP4.5 31.85,-43.76 B2.A11
N$50
  Bottom 1.422: JP4.4 34.39,-43.76 B2.A12
N$51
  Bottom 1.422: JP4.3 36.93,-43.76 B2.A13
N$52
  Bottom 1.422: JP4.2 39.47,-43.76 B2.A14
N$53
  Bottom 1.016: JP20.3 44.6,-3.07 B2.26
N$54
  Bottom 1.422: B2.49 50.62,-30.95 JP3.3
N$55
  Bottom 1.422: B2.47 50.62,-28.41 JP3.4
N$56
  Bottom 1.422: B2.45 50.62,-25.86 JP3.5
N$57
  Bottom 1.422: B2.43 50.17,-23.32 50.2,-23.3 50.65,-23.3 JP3.6
N$58
  Bottom 1.016: B2.28 41.56,-5.54 JP20.4
N$59
  Bottom 1.422: B2.41 50.62,-20.79 JP3.7
N$60
  Bottom 1.422: B2.39 50.62,-18.25 JP3.8
N$61
  Bottom 1.422: B2.37 50.62,-15.71 JP3.9
N$62
  Bottom 1.422: B2.35 50.62,-13.16 JP3.10
N$63
  Bottom 1.422: B2.33 50.62,-10.62 JP3.11
N$64
  Bottom 1.422: B2.31 50.62,-8.09 JP3.12
N$65
  Bottom 1.422: B2.29 50.62,-5.54 JP3.13
N$66
  Bottom 1.422: B2.27 50.62,-3 JP3.14
N$67
  Bottom 1.422: B2.25 50.62,-0.47 JP3.15
N$68
  Bottom 1.422: B2.23 50.62,2.08 JP3.16
N$69
  Bottom 1.016: B2.20 34.5,7.39 JP5.7
N$70
  Bottom 1.016: R24.1 JP15.3 25.7,-4.79 25.7,-2 24.83,-1.13 LED4.K
N$71
  Bottom 1.016: R26.1 23.09,-4.86 JP15.4 23,-4.66 23,-3 22.5,-2.5 22.5,-1.8 21.67,-0.97 LED5.K
N$74
  Bottom 1.016: R28.2 -72.5,46.15 R29.1 -72.4,42.17 LED6.A
N$75
  Bottom 1.016: B2.21 37.04,7.39 JP5.8
N$76  (via drill 0.6 pad 1.68)
  other vias: -4.1,-2.9
N$78  (via drill 0.6 pad 1.68)
  other vias: -25.4,-2.2
N$79
  Bottom 1.016: B2.A7 19.26,-40.45 JP21.1
N$80
  Bottom 1.016: B2.7 -3.6,7.44 JP10.1
N$81
  Bottom 1.016: B2.6 -1.06,7.44 JP10.2
N$82
  Bottom 1.016: B2.A6 16.72,-40.45 JP21.2
N$83  (via drill 0.6 pad 2.18)
  other vias: -31.1,19.8
N$84  (via drill 0.6 pad 2.18)
  other vias: 0.5,39.8
N$85  (via drill 0.6 pad 2.18)
  other vias: 79.2,-10.6
N$86
  Bottom 1.016: B2.1 11.64,7.44 JP10.7
N$87
  Bottom 1.016: B2.0 14.18,7.44 JP10.8
N$88
  Bottom 1.016: B2.14 19.26,7.39 JP5.1
N$89
  Bottom 1.016: B2.15 21.8,7.39 JP5.2
N$90
  Bottom 1.016: B2.16 24.34,7.39 JP5.3
N$91
  Bottom 1.016: B2.17 26.88,7.39 JP5.4
N$92  (via drill 0.6 pad 2.18)
  other vias: 67.7,-8.5
N$93  (via drill 0.6 pad 2.18)
  other vias: 74.7,-8.8
N$94  (via drill 0.6 pad 2.18)
  other vias: -3.9,-3
N$95  (via drill 0.6 pad 2.18)
  other vias: -32.1,-7.9
N$96
  Bottom 1.016: JP20.1 44.6,2.01 B2.22
N$97  (via drill 0.6 pad 2.18)
  other vias: -33.5,84.3
N$98  (via drill 0.6 pad 2.18)
  other vias: -34.4,95.8
N$110
  Bottom 1.016: JP19.1 41.07,-34.73 42.3,-33.5 44.65,-33.5 B2.50
N$111
  Bottom 1.016: JP19.2 42.33,-37.27 43.1,-36.5 44.19,-36.5 B2.52
N$112
  Bottom 1.016: R25.2 -47.18,-19.38 -46.6,-18.8 -46.6,-15.85 LED13.A
PWM1
  Bottom 1.016: B2.2 9.1,7.44 JP10.6 9.09,10.12 R4.1
PWM2
  Bottom 1.016: B2.4 4.02,7.44 JP10.4 4.01,10.48 R8.1
PWM3
  Bottom 1.016: JP12.1 -4.28,79.44 -2.64,81.09 -2.64,87.2 R12.1
  Bottom 1.27: JP12.2 JP12.1
PWM4
  Bottom 1.016: JP12.5 -16.79,80.44 -13.94,83.29 -6.84,83.29 -6.64,83.89 -6.64,89.79 -4.14,92.19 -3.57,92.19 R16.1
  Bottom 1.27: JP12.6 JP12.5
RESET
  Bottom 1.27: R20.1 -15.8,-41.2 -16.3,-41.7 | -16.3,-41.7 B2.RESET | S7.1 S7.2 -20.53,-39.97 -19.4,-41.1 -16.9,-41.1 -16.3,-41.7
RS
  Bottom 1.016: DIS1.4 -25.27,-12.26 JP18.3 -25.27,-18.23 -23.3,-20.2 -14.5,-20.2 -2.3,-32.4 39.6,-32.4 41.3,-30.7 44.42,-30.7 B2.48
RX1
  Bottom 1.016: B2.19 31.96,7.39 JP5.6 32,7.45 32,9.6 33.1,10.9 40.3,10.9 45,6.6 61,6.6 62.9,4.7 62.9,2.8 63.82,1.88 V1.18
SCL  (via drill 0.6, 0.6 pad 1.68)
  Top 1.016: v-4.3,0.9 -4.4,-2.5 v-4,-2.9 | v-6.4,9.6 -6.4,7.2 -5.3,6.1 -5.3,3.6 v-2.9,0.9
  Bottom 1.016: v-4.3,0.9 v-2.9,0.9 -0.82,0.92 0.18,0.92 1.2,-0.1 2,-0.1 R3.1 | v-4,-2.9 -4,-3 -3.2,-3.8 -3.2,-6.27 U1.SCL | B2.SCL -30.27,15.1 | -30.27,15.1 -30.27,15.43 -25.6,20.1 -9.1,20.1 -7.8,18.8 -7.8,15.7 -6.4,14.3 v-6.4,9.6 | JP23.2 JP23.1 -30.74,14.63 -30.27,15.1
SDA  (via drill 0.6, 0.6 pad 1.68, 0.6 pad 2.18)
  Top 1.016: v-25.3,-2.2 -22.2,-2.2 v-20.1,-1 | v-34.7,9.2 v-28,9.2 v-27.9,9.2
  Bottom 1.016: v-25.3,-2.2 v-25.4,-2.1 -27.73,0.23 B2.SDA -27.9,4.79 v-27.9,9.2 | -0.65,-3.45 -2.2,-1.1 -20.2,-1.1 v-20.1,-1 | -0.65,-3.45 -0.7,-3.7 -0.7,-6.28 U1.SDA | JP23.4 JP23.3 -38.63,13.13 v-34.7,9.2 | R21.1 0.03,-2.77 -0.65,-3.45
TX1
  Bottom 1.016: B2.18 29.42,7.39 JP5.5 29.4,10.4 31.4,12.7 41.4,12.7 45.8,8.5 61.7,8.5 65.78,4.42 V1.17
VCC  (via drill 0.6 pad 1.68, 0.6 pad 2.18)
  Top 1.016: v-12.1,1.6 v-12.1,-6.1
  Top 1.422: v-32.2,-8 -32.2,-0.3 v-34.9,2.4
  Bottom 0.813: 3.9,-9.1 11.9,-9.1 12,-9 | 4,2.4 -1.2,2.4 -1.5,2.7 -6.6,2.7
  Bottom 1.016: JP18.5 -30.3,-15.85 DIS1.2 -30.3,-10.2 -30.1,-10 | JP17.2 DIS1.15 | 17.4,-2.6 17.4,0.4 18.57,1.57 LED5.A 24.17,1.57 LED4.A 28.69,1.41 LED3.A 33.15,1.32 LED2.A 37.08,1.28 40.6,4.8 44.48,4.8 B2.5V@1 | 17.4,-2.6 17.4,-4 18.2,-4.8 20.7,-4.8 21,-4.5 20.91,-4.5 JP15.5 | R21.2 9.55,-0.28 R3.2 | R21.2 9.55,-2.85 | 17.4,-2.6 17.1,-2.9 13.4,-2.9 12.7,-3.6 12.1,-3.6 11.4,-2.9 9.7,-2.9 | V1.20 60.17,-3.2 JP14.3 | B2.5V@2 58.59,4.62 59.8,3.4 JP14.1 | JP22.2 JP22.4 JP22.6 -28.39,-46.51 -30.1,-44.8 -30.1,-23.4 | 2.72,-10.18 3.9,-9 | 12,-9 13.3,-7.7 13.3,-3.1 13.4,-3 | 9.7,-2.9 9.7,-0.3 6.7,-0.3 4,2.4 | v-12.1,1.6 -7.7,1.6 -6.6,2.7 | v-12.1,-6.1 v-12.1,-6.09 -11.9,-6.29 | R25.1 -42.58,-19.38 -43.9,-20.7 -43.9,-24.3 -42.1,-26.1 -32.8,-26.1 -30.1,-23.4 | -30.1,-23.4 -30.1,-16.15 JP18.5 | R1.2 -11.29,-39.91 -13.85,-37.35 | -13.85,-37.35 -14.1,-37.1 -14.1,-33.6 R20.2 | JP18.5 -30.35,-23.05 -27.7,-25.7 -13.3,-25.7 -7.5,-31.5 -7.5,-34.7 -9.9,-37.1 -13.6,-37.1 -13.85,-37.35 | JP23.8 JP23.7 -43.71,3.81 -42.3,2.4 | 9.7,-2.9 9.68,-2.9 R21.2
  Bottom 1.27: B2.5V -11.22,-41.33 R1.2 | JP22.2 -33.5,-52.12 -33.5,-50.6 -35.97,-48.13 -45.3,-48.13 -45.6,-47.83 | U1.VCC -11.9,-6.29 -14.09,-6.29 -14.8,-7 -27.1,-7 -28.3,-8.2 | -28.3,-8.2 -30.1,-10 | DIS1.15 2.72,-10.18 3.9,-9.1 | 12.1,-9.1 13.4,-7.6 13.4,-3 13.4,-2.9 | v-32.2,-8 -28.5,-8 -28.3,-8.2
  Bottom 1.422: JP14.16 JP14.15 JP14.14 JP14.13 JP14.12 JP14.11 JP14.10 JP14.9 JP14.8 JP14.7 JP14.6 JP14.5 JP14.4 JP14.3 JP14.2 JP14.1 | B2.5V@1 B2.5V@2 | v-34.9,2.4 v-35.2,2.4 -42.3,2.4 -42.66,2.4 BUZZER.+
  Bottom 1.676: -45.6,-47.83 -45.6,-44.9 -47.2,-43.3 -56.05,-43.3 U$3.OUT+
(copper drawn outside any net)
  shapes: Bottom area x10, Bottom circle x4

### Text on the board
Bottom: otomasi.sv.ugm.ac.id | otomasi.sv.ugm.ac.id | Tirza Sarwono